# EAGLE schematic AK4493-Combi4 (EAGLE 9.6.2)
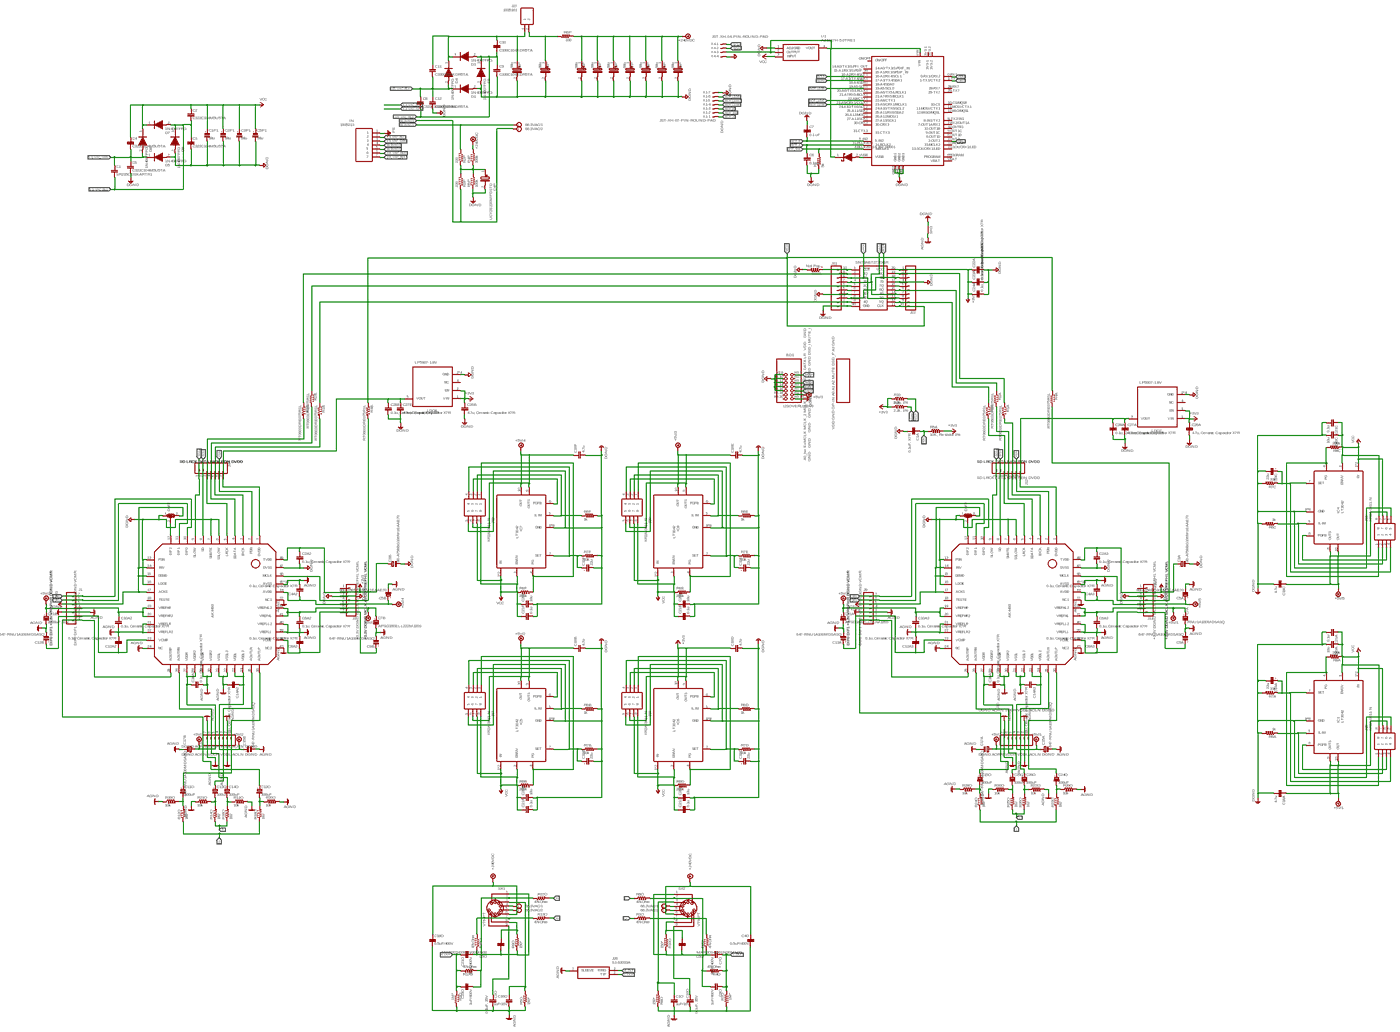
[diagram p0: schematic, sheet 1, overview]
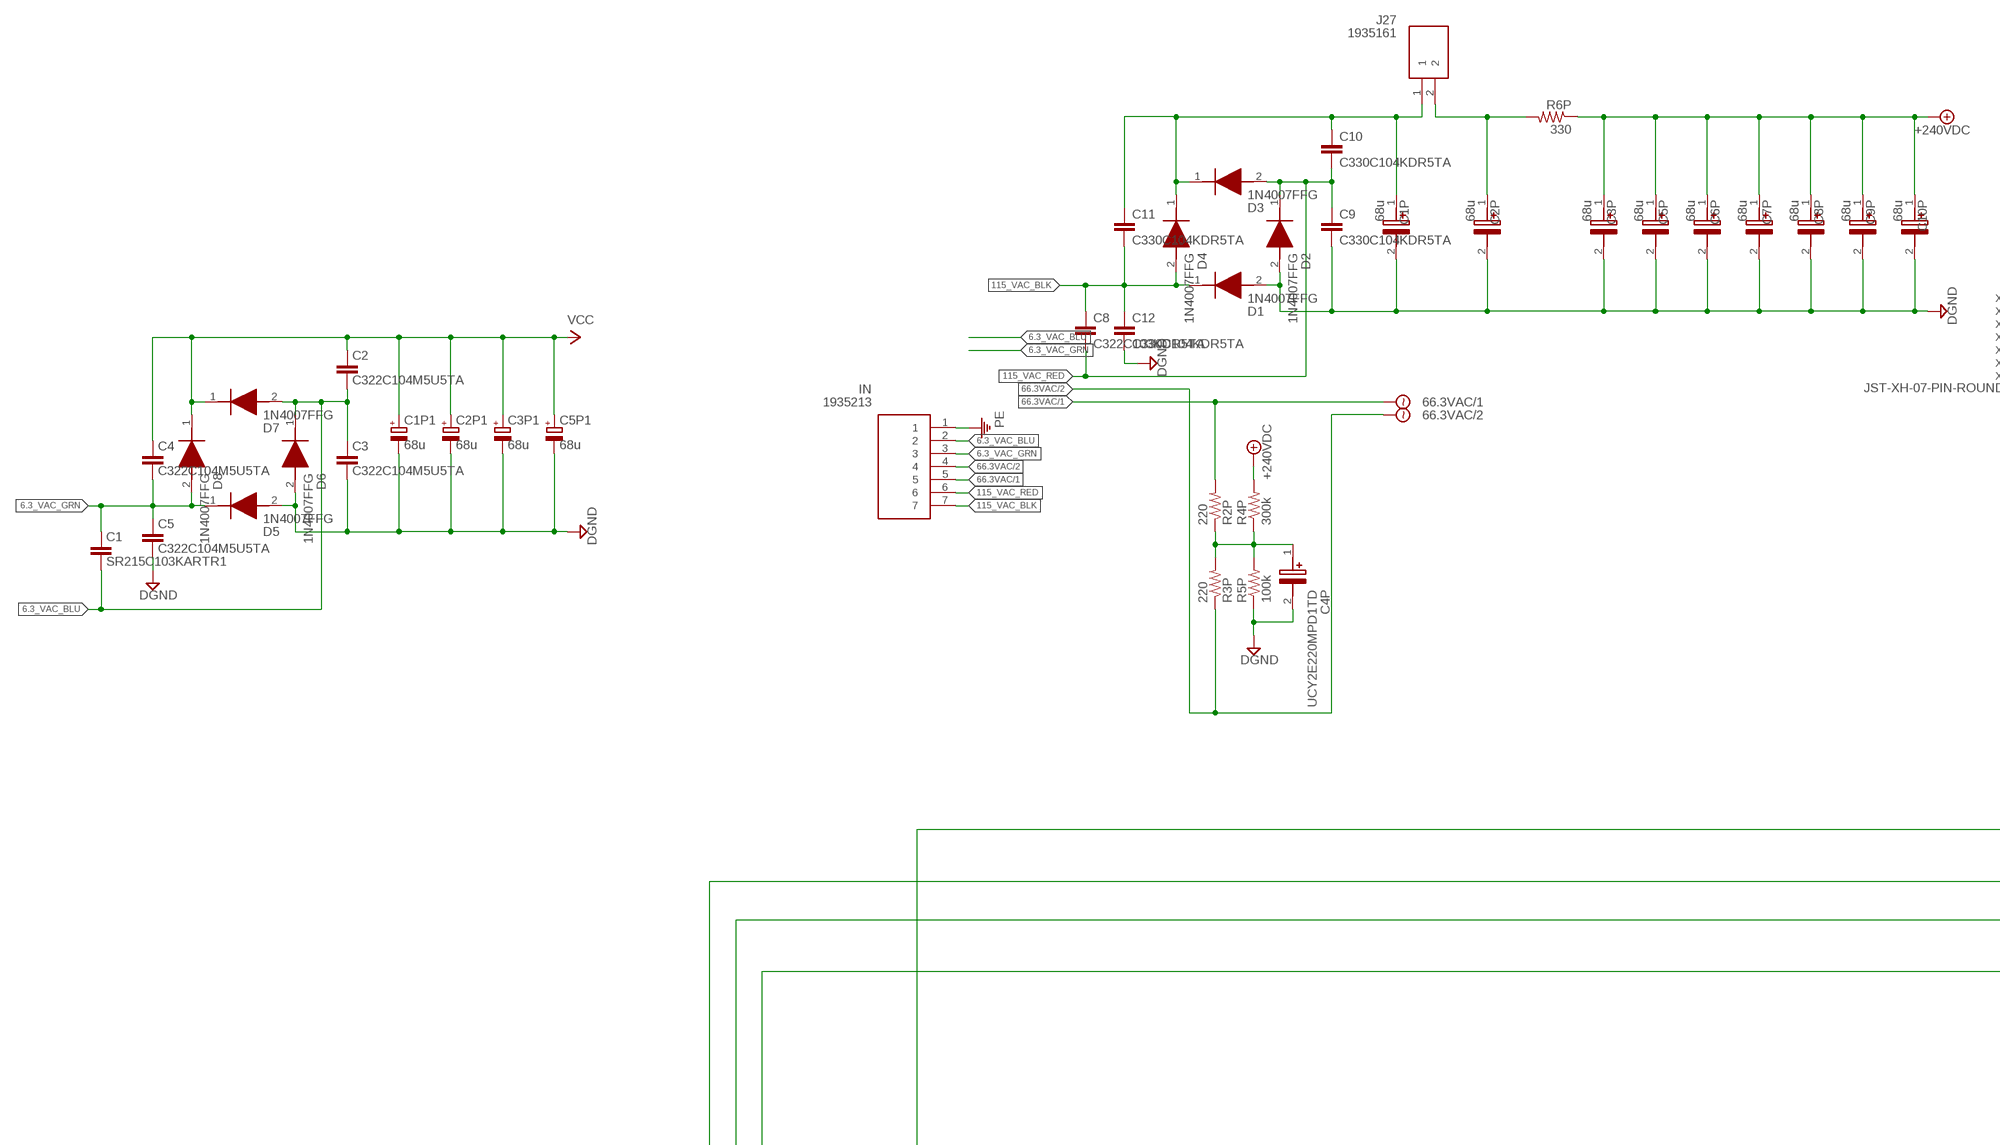
[diagram p1: schematic, sheet 1, part 1 of 4]
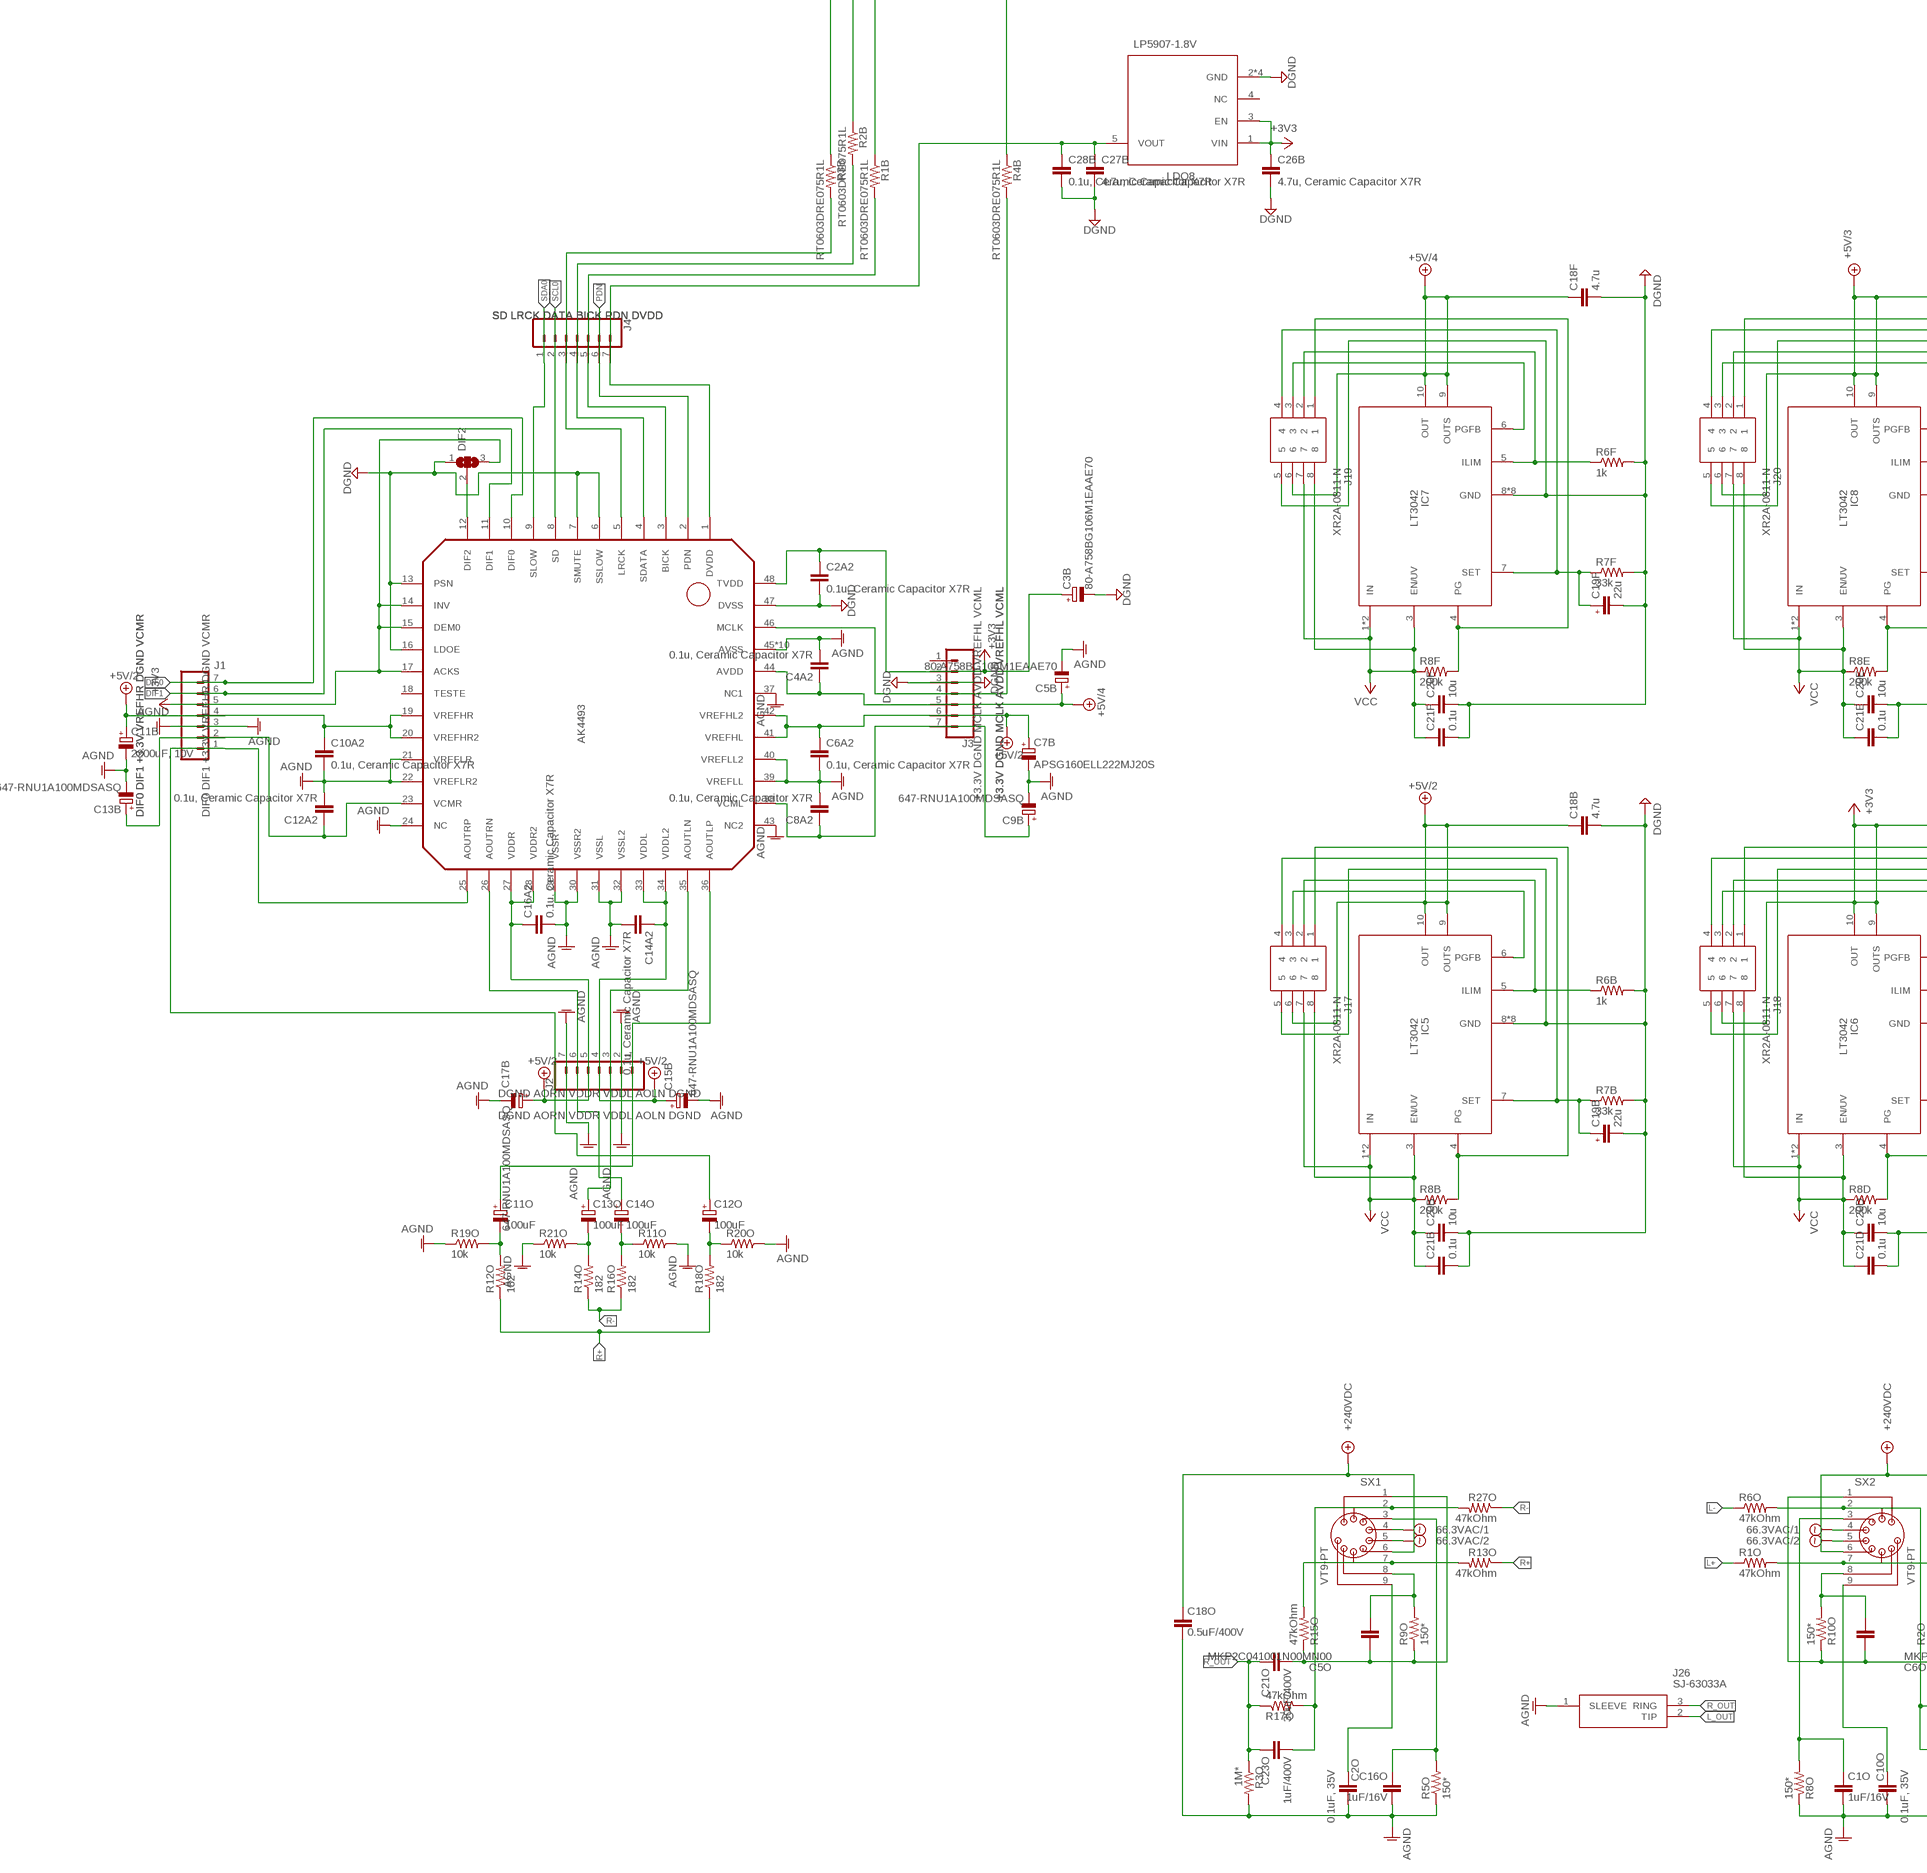
[diagram p2: schematic, sheet 1, part 2 of 4]
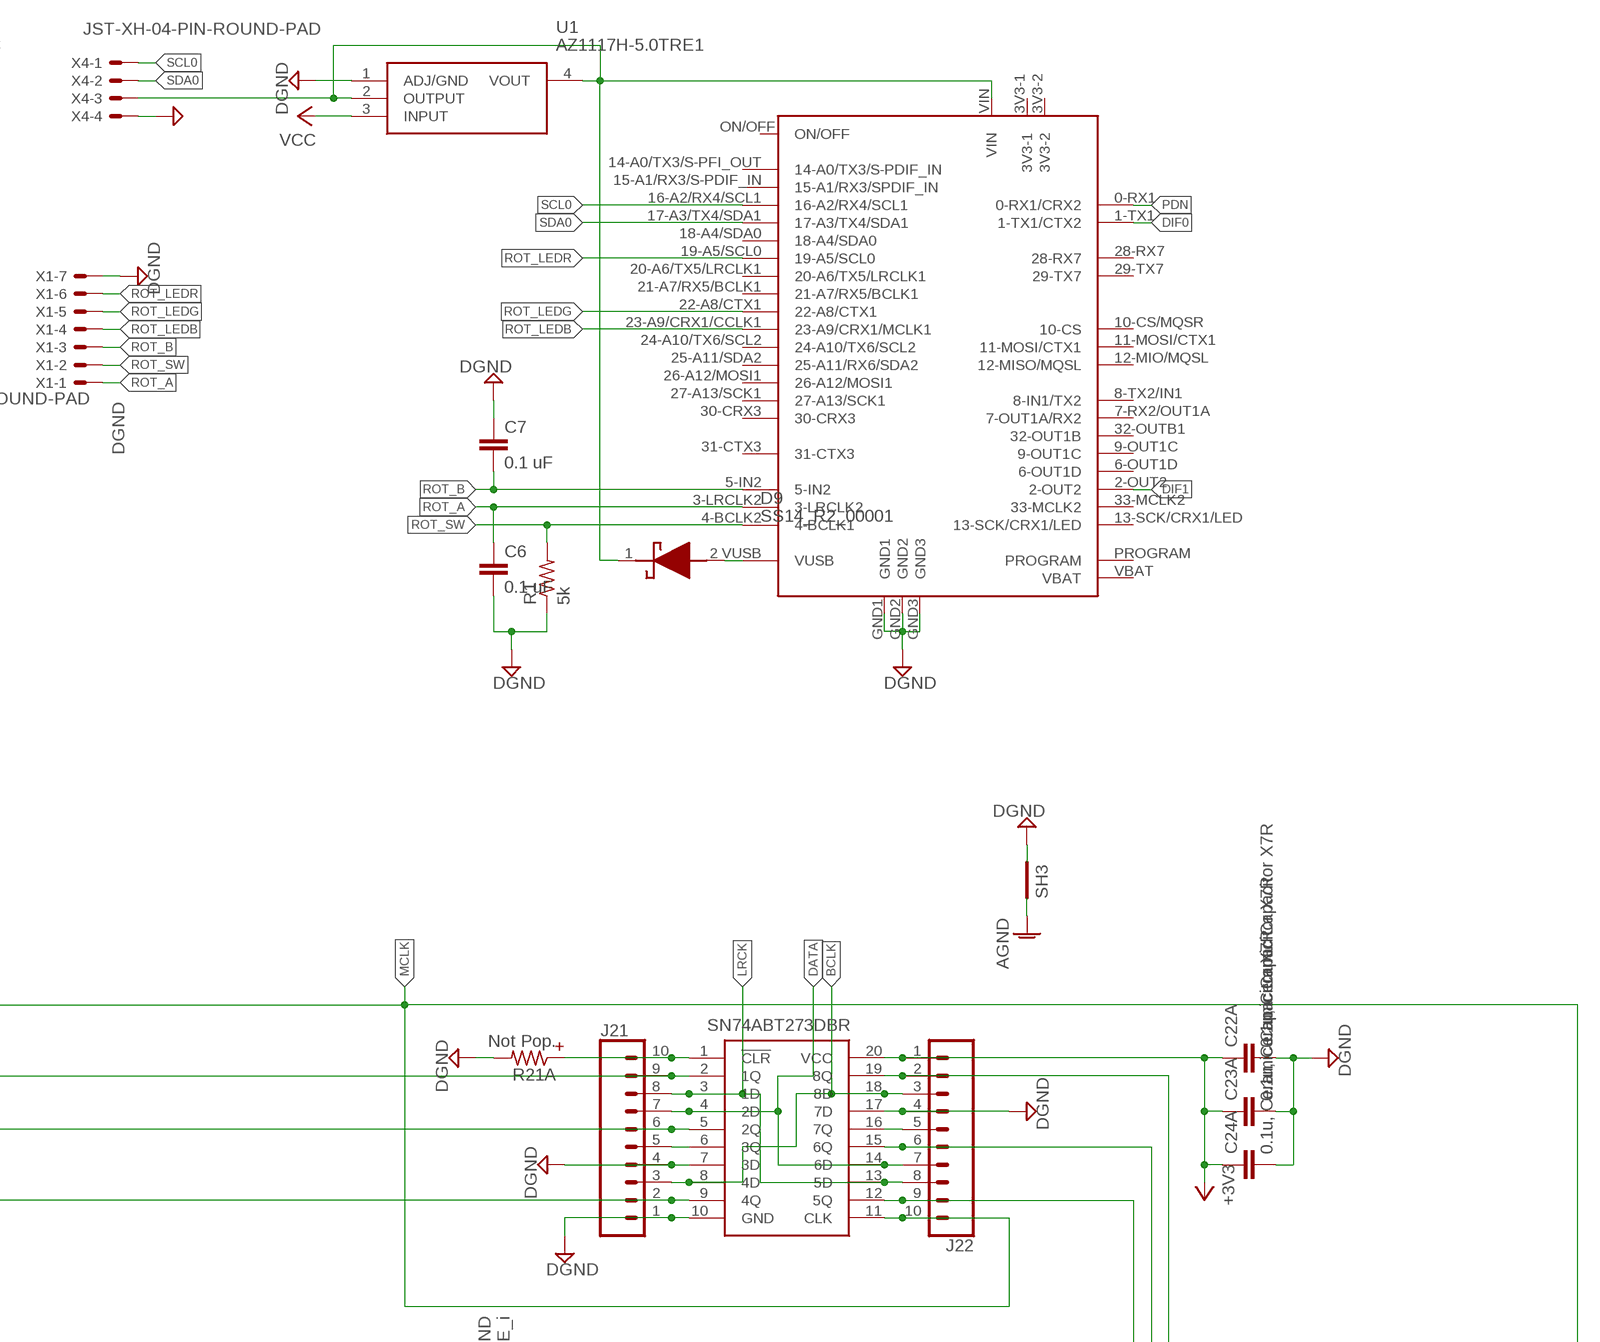
[diagram p3: schematic, sheet 1, part 3 of 4]
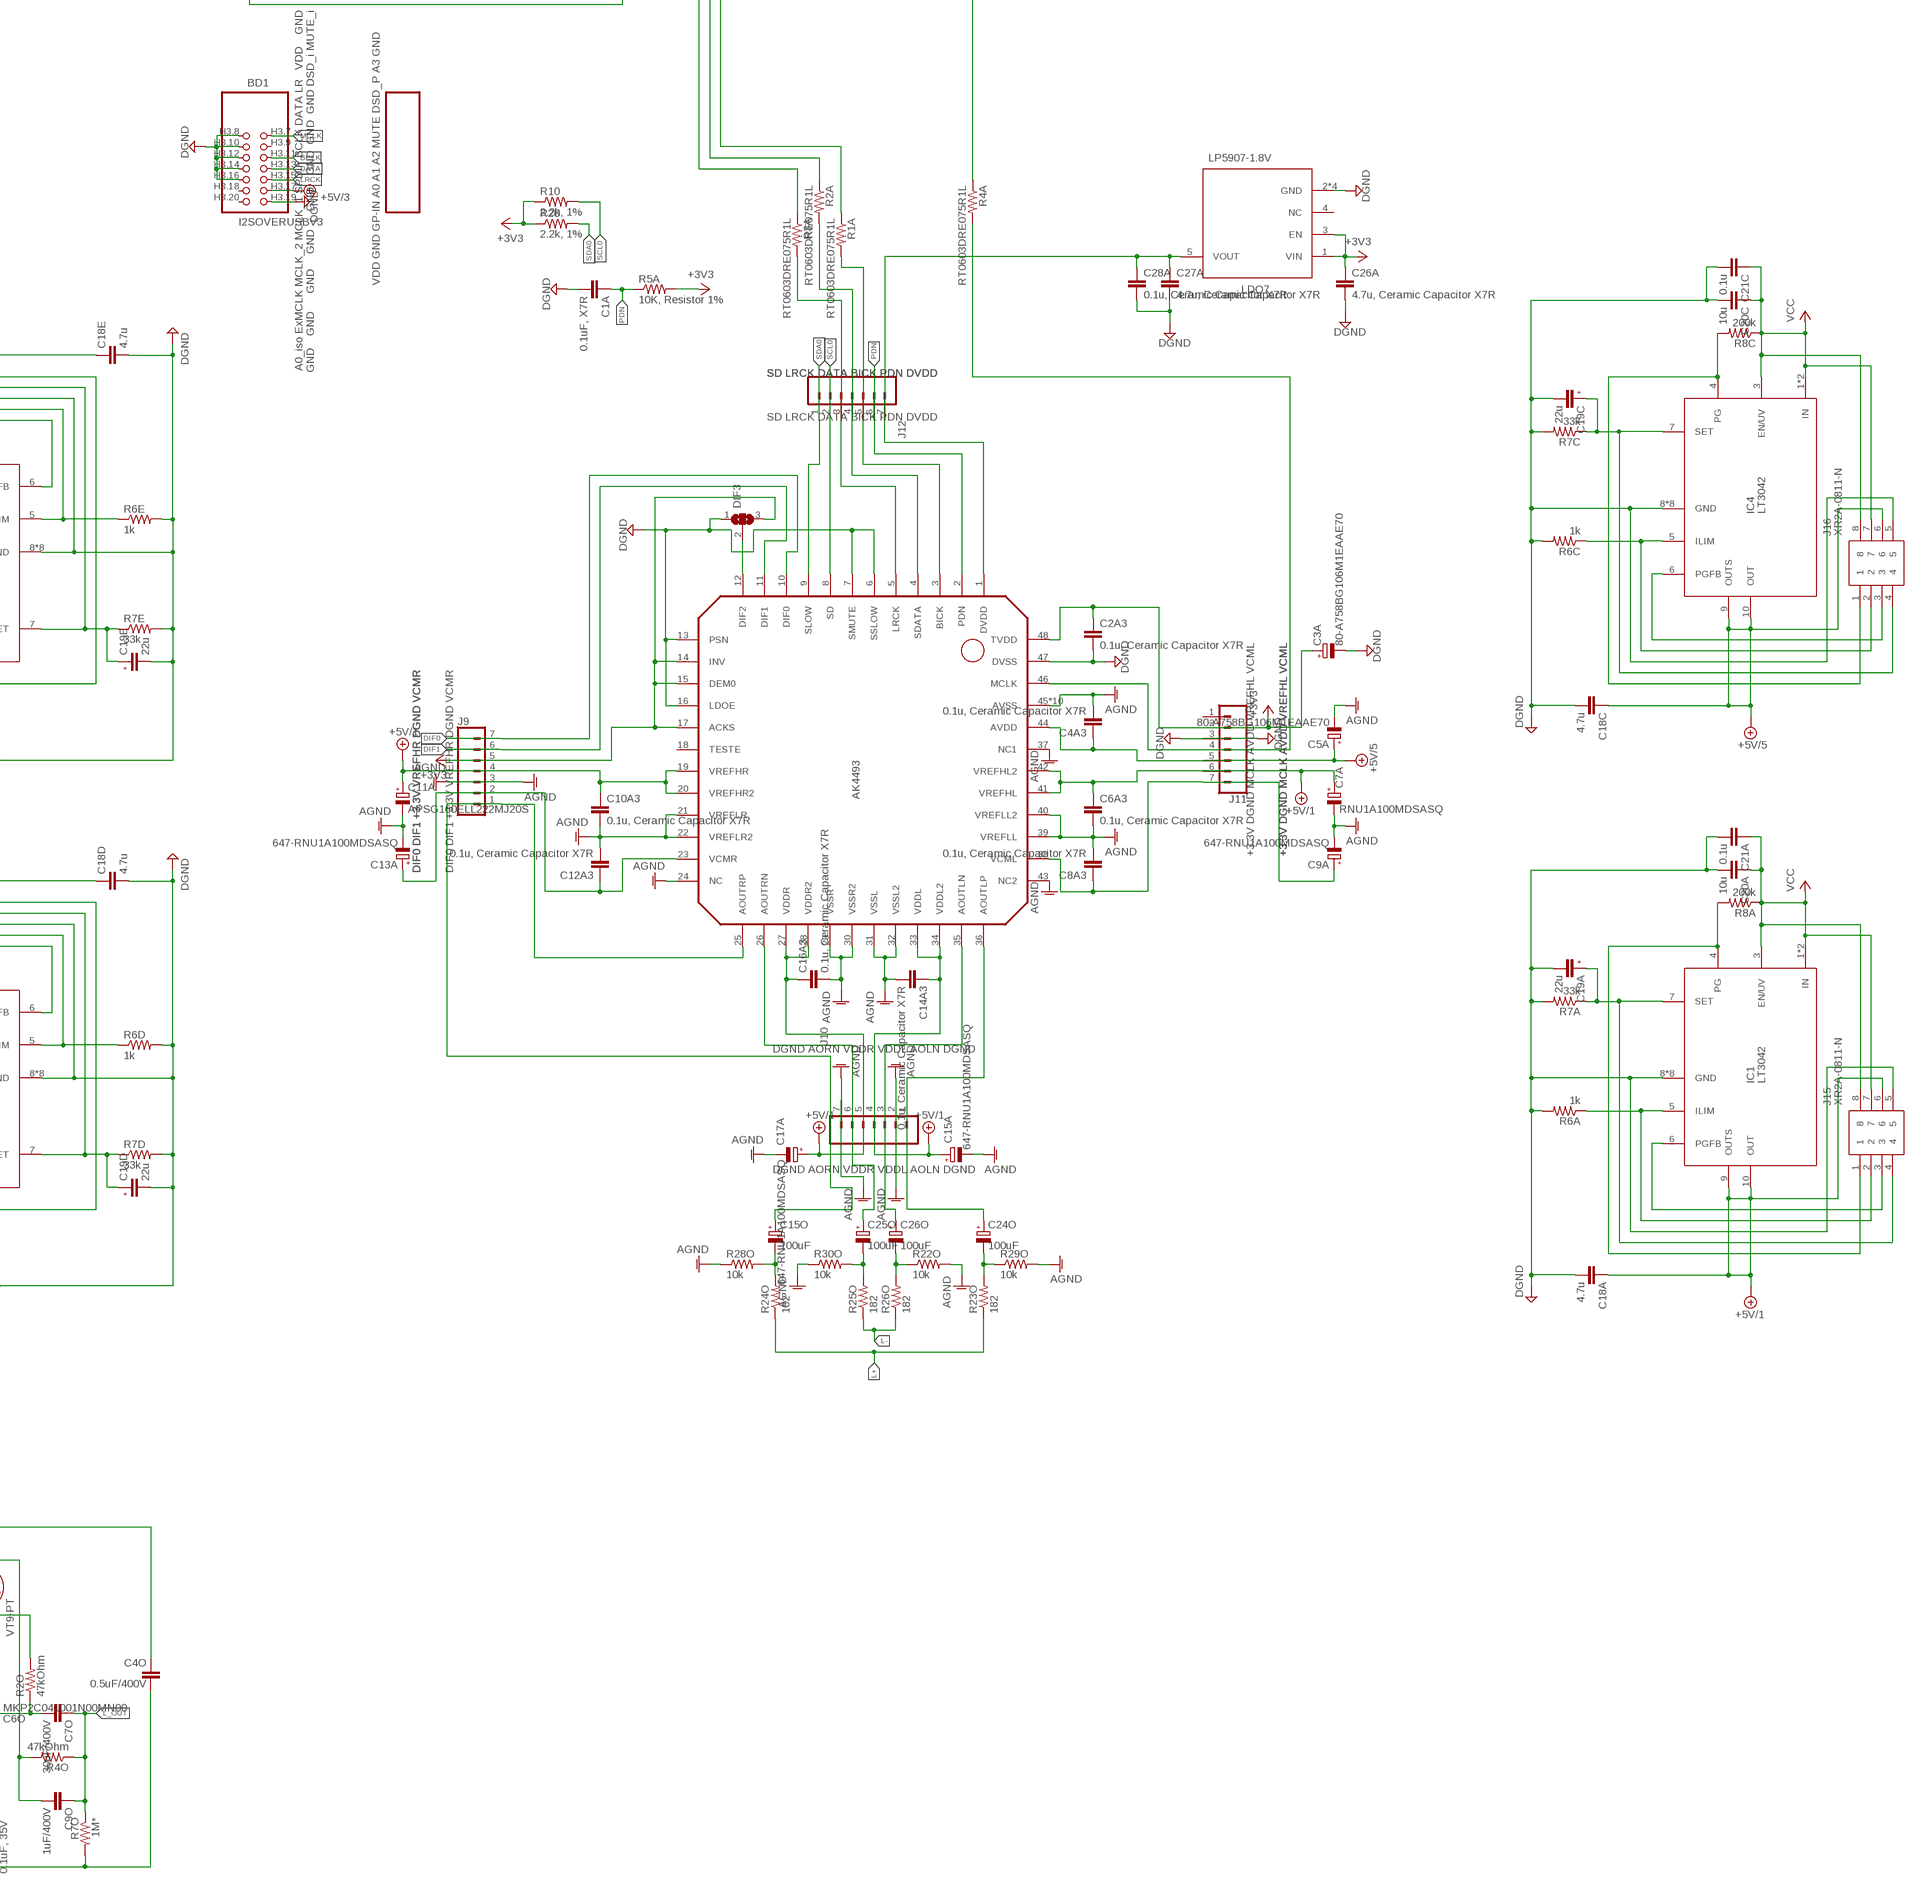
[diagram p4: schematic, sheet 1, part 4 of 4]

## Parts
BD1  I2SOVERUSBV3  [I2SOVERUSBV3]
C1  SR215C103KARTR1  [SR211C104KARTR1]
C1A  0.1uF, X7R  EMF212B7104KGHT  [CAPC2012X135N]
C1O  1uF/16V  MKP2C041001N00MN00  [MKP2C041001N00MN00]
C1P  68u  500HXW68MEFR14.5X45  [CAPPRD750W80D1475H4700]
C1P1  68u  35PX6800MEFC18X35.5  [CAPPRD750W80D1825H3750]
C2  C322C104M5U5TA  [C322C104K1R5TA]
C2A2  0.1u, Ceramic Capacitor X7R  EMK107B7104KA-T  [CAPC1608X95N]
C2A3  0.1u, Ceramic Capacitor X7R  EMK107B7104KA-T  [CAPC1608X95N]
C2O  0.1uF, 35V  MKS4B031002A00JC00  [MKS4B031002A00JC00]
C2P  68u  500HXW68MEFR14.5X45  [CAPPRD750W80D1475H4700]
C2P1  68u  35PX6800MEFC18X35.5  [CAPPRD750W80D1825H3750]
C3  C322C104M5U5TA  [C322C104K1R5TA]
C3A  80-A758BG106M1EAAE70  RNU1A100MDSASQ  [CAPPRD150W45D450H600]
C3B  80-A758BG106M1EAAE70  A758BG106M1EAAE070  [CAPPRD200W55D500H800]
C3P  68u  500HXW68MEFR14.5X45  [CAPPRD750W80D1475H4700]
C3P1  68u  35PX6800MEFC18X35.5  [CAPPRD750W80D1825H3750]
C4  C322C104M5U5TA  [C322C104K1R5TA]
C4A2  0.1u, Ceramic Capacitor X7R  EMK107B7104KA-T  [CAPC1608X95N]
C4A3  0.1u, Ceramic Capacitor X7R  EMK107B7104KA-T  [CAPC1608X95N]
C4O  0.5uF/400V  MKP4G034705D00KSSD  [MKP4G034705D00KSSD]
C4P  UCY2E220MPD1TD  [CAPPRD500W60D1025H1750]
C5  C322C104M5U5TA  [C322C104K1R5TA]
C5A  80-A758BG106M1EAAE70  A758BG106M1EAAE070  [CAPPRD200W55D500H800]
C5B  80-A758BG106M1EAAE70  A758BG106M1EAAE070  [CAPPRD200W55D500H800]
C5O  MKP2C041001N00MN00  [MKP2C041001N00MN00]
C5P  68u  500HXW68MEFR14.5X45  [CAPPRD750W80D1475H4700]
C5P1  68u  35PX6800MEFC18X35.5  [CAPPRD750W80D1825H3750]
C6  0.1 uF  EMF212B7104KGHT  [CAPC2012X135N]
C6A2  0.1u, Ceramic Capacitor X7R  EMK107B7104KA-T  [CAPC1608X95N]
C6A3  0.1u, Ceramic Capacitor X7R  EMK107B7104KA-T  [CAPC1608X95N]
C6O  MKP2C041001N00MN00  [MKP2C041001N00MN00]
C6P  68u  500HXW68MEFR14.5X45  [CAPPRD750W80D1475H4700]
C7  0.1 uF  EMF212B7104KGHT  [CAPC2012X135N]
C7A  RNU1A100MDSASQ  [CAPPRD150W45D450H600]
C7B  APSG160ELL222MJ20S  [CAPPRD500W60D1025H2150]
C7O  30uF/400V  DCP4G053006ID2KSSD  [DCP4G053006ID2KSSD]
C7P  68u  500HXW68MEFR14.5X45  [CAPPRD750W80D1475H4700]
C8  C322C103KDR5TA  [C322C101JCG5TA7301]
C8A2  0.1u, Ceramic Capacitor X7R  EMK107B7104KA-T  [CAPC1608X95N]
C8A3  0.1u, Ceramic Capacitor X7R  EMK107B7104KA-T  [CAPC1608X95N]
C8P  68u  500HXW68MEFR14.5X45  [CAPPRD750W80D1475H4700]
C9  C330C104KDR5TA  [C330C104KDR5TA]
C9A  647-RNU1A100MDSASQ  RNU1A100MDSASQ  [CAPPRD150W45D450H600]
C9B  647-RNU1A100MDSASQ  RNU1A100MDSASQ  [CAPPRD150W45D450H600]
C9O  1uF/400V  MKP4G041005I00JSSD  [MKP4G041005I00JSSD]
C9P  68u  500HXW68MEFR14.5X45  [CAPPRD750W80D1475H4700]
C10  C330C104KDR5TA  [C330C104KDR5TA]
C10A2  0.1u, Ceramic Capacitor X7R  EMK107B7104KA-T  [CAPC1608X95N]
C10A3  0.1u, Ceramic Capacitor X7R  EMK107B7104KA-T  [CAPC1608X95N]
C10O  0.1uF, 35V  MKS4B031002A00JC00  [MKS4B031002A00JC00]
C10P  68u  500HXW68MEFR14.5X45  [CAPPRD750W80D1475H4700]
C11  C330C104KDR5TA  [C330C104KDR5TA]
C11A  APSG160ELL222MJ20S  [CAPPRD500W60D1025H2150]
C11B  2200uF, 10V  APSG160ELL222MJ20S  [CAPPRD500W60D1025H2150]
C11O  100uF  UFW1H101MPD1TD  [CAPPRD350W60D825H1300]
C12  C330C104KDR5TA  [C330C104KDR5TA]
C12A2  0.1u, Ceramic Capacitor X7R  EMK107B7104KA-T  [CAPC1608X95N]
C12A3  0.1u, Ceramic Capacitor X7R  EMK107B7104KA-T  [CAPC1608X95N]
C12O  100uF  UFW1H101MPD1TD  [CAPPRD350W60D825H1300]
C13A  647-RNU1A100MDSASQ  RNU1A100MDSASQ  [CAPPRD150W45D450H600]
C13B  647-RNU1A100MDSASQ  RNU1A100MDSASQ  [CAPPRD150W45D450H600]
C13O  100uF  UFW1H101MPD1TD  [CAPPRD350W60D825H1300]
C14A2  0.1u, Ceramic Capacitor X7R  EMK107B7104KA-T  [CAPC1608X95N]
C14A3  0.1u, Ceramic Capacitor X7R  EMK107B7104KA-T  [CAPC1608X95N]
C14O  100uF  UFW1H101MPD1TD  [CAPPRD350W60D825H1300]
C15A  647-RNU1A100MDSASQ  RNU1A100MDSASQ  [CAPPRD150W45D450H600]
C15B  647-RNU1A100MDSASQ  RNU1A100MDSASQ  [CAPPRD150W45D450H600]
C15O  100uF  UFW1H101MPD1TD  [CAPPRD350W60D825H1300]
C16A2  0.1u, Ceramic Capacitor X7R  EMK107B7104KA-T  [CAPC1608X95N]
C16A3  0.1u, Ceramic Capacitor X7R  EMK107B7104KA-T  [CAPC1608X95N]
C16O  1uF/16V  MKP2C041001N00MN00  [MKP2C041001N00MN00]
C17A  647-RNU1A100MDSASQ  RNU1A100MDSASQ  [CAPPRD150W45D450H600]
C17B  647-RNU1A100MDSASQ  RNU1A100MDSASQ  [CAPPRD150W45D450H600]
C18A  4.7u  EMK212ABJ475KG-T  [CAPC2013X140N]
C18B  4.7u  EMK212ABJ475KG-T  [CAPC2013X140N]
C18C  4.7u  EMK212ABJ475KG-T  [CAPC2013X140N]
C18D  4.7u  EMK212ABJ475KG-T  [CAPC2013X140N]
C18E  4.7u  EMK212ABJ475KG-T  [CAPC2013X140N]
C18F  4.7u  EMK212ABJ475KG-T  [CAPC2013X140N]
C18O  0.5uF/400V  MKP4G034705D00KSSD  [MKP4G034705D00KSSD]
C19A  22u  EMK316BB7226ML-T  [C1206]
C19B  22u  EMK316BB7226ML-T  [C1206]
C19C  22u  EMK316BB7226ML-T  [C1206]
C19D  22u  EMK316BB7226ML-T  [C1206]
C19E  22u  EMK316BB7226ML-T  [C1206]
C19F  22u  EMK316BB7226ML-T  [C1206]
C20A  10u  EMK212BB7106KG-T  [CAPC2012X135N]
C20B  10u  EMK212BB7106KG-T  [CAPC2012X135N]
C20C  10u  EMK212BB7106KG-T  [CAPC2012X135N]
C20D  10u  EMK212BB7106KG-T  [CAPC2012X135N]
C20E  10u  EMK212BB7106KG-T  [CAPC2012X135N]
C20F  10u  EMK212BB7106KG-T  [CAPC2012X135N]
C21A  0.1u  EMF212B7104KGHT  [CAPC2012X135N]
C21B  0.1u  EMF212B7104KGHT  [CAPC2012X135N]
C21C  0.1u  EMF212B7104KGHT  [CAPC2012X135N]
C21D  0.1u  EMF212B7104KGHT  [CAPC2012X135N]
C21E  0.1u  EMF212B7104KGHT  [CAPC2012X135N]
C21F  0.1u  EMF212B7104KGHT  [CAPC2012X135N]
C21O  30uF/400V  DCP4G053006ID2KSSD  [DCP4G053006ID2KSSD]
C22A  0.1u, Ceramic Capacitor X7R  EMF212B7104KGHT  [CAPC2012X135N]
C23A  0.1u, Ceramic Capacitor X7R  EMF212B7104KGHT  [CAPC2012X135N]
C23O  1uF/400V  MKP4G041005I00JSSD  [MKP4G041005I00JSSD]
C24A  0.1u, Ceramic Capacitor X7R  EMF212B7104KGHT  [CAPC2012X135N]
C24O  100uF  UFW1H101MPD1TD  [CAPPRD350W60D825H1300]
C25O  100uF  UFW1H101MPD1TD  [CAPPRD350W60D825H1300]
C26A  4.7u, Ceramic Capacitor X7R  EMK212ABJ475KG-T  [CAPC2013X140N]
C26B  4.7u, Ceramic Capacitor X7R  EMK212ABJ475KG-T  [CAPC2013X140N]
C26O  100uF  UFW1H101MPD1TD  [CAPPRD350W60D825H1300]
C27A  4.7u, Ceramic Capacitor X7R  EMK212ABJ475KG-T  [CAPC2013X140N]
C27B  4.7u, Ceramic Capacitor X7R  EMK212ABJ475KG-T  [CAPC2013X140N]
C28A  0.1u, Ceramic Capacitor X7R  EMF212B7104KGHT  [CAPC2012X135N]
C28B  0.1u, Ceramic Capacitor X7R  EMF212B7104KGHT  [CAPC2012X135N]
D1  1N4007FFG  [DIOAD1405W86L465D235]
D2  1N4007FFG  [DIOAD1405W86L465D235]
D3  1N4007FFG  [DIOAD1405W86L465D235]
D4  1N4007FFG  [DIOAD1405W86L465D235]
D5  1N4007FFG  [DIOAD1405W86L465D235]
D6  1N4007FFG  [DIOAD1405W86L465D235]
D7  1N4007FFG  [DIOAD1405W86L465D235]
D8  1N4007FFG  [DIOAD1405W86L465D235]
D9  SS14_R2_00001  [DIOM5027X244N]
DIF2  SJ2W  [SJ_2]
DIF3  SJ2W  [SJ_2]
IC1  LT3042  [SOP50P490X110-11N]
IC3  AK4493  [LQFP48_]
IC4  LT3042  [SOP50P490X110-11N]
IC4A  SN74ABT273DBR  [SOP65P780X200-20N]
IC5  LT3042  [SOP50P490X110-11N]
IC6  LT3042  [SOP50P490X110-11N]
IC7  LT3042  [SOP50P490X110-11N]
IC8  LT3042  [SOP50P490X110-11N]
IC9  AK4493  [LQFP48_]
IN  1935213  [1935213]
J1  CONN_07  [1X07]
J2  CONN_07  [1X07]
J3  CONN_07  [1X07]
J4  CONN_07  [1X07]
J9  CONN_07  [1X07]
J10  CONN_07  [1X07]
J11  CONN_07  [1X07]
J12  CONN_07  [1X07]
J15  XR2A-0811-N  [DIPS762W51P254L1016H390Q8N]
J16  XR2A-0811-N  [DIPS762W51P254L1016H390Q8N]
J17  XR2A-0811-N  [DIPS762W51P254L1016H390Q8N]
J18  XR2A-0811-N  [DIPS762W51P254L1016H390Q8N]
J19  XR2A-0811-N  [DIPS762W51P254L1016H390Q8N]
J20  XR2A-0811-N  [DIPS762W51P254L1016H390Q8N]
J21  CONN_10"  [1X10]
J22  CONN_10"  [1X10]
J26  SJ-63033A  [SJ63033A]
J27  1935161  [1935161]
LDO7  LP5907-1.8V  [SOT95P280X145-5N]
LDO8  LP5907-1.8V  [SOT95P280X145-5N]
R1  5k  ERJ-P06J512V  [ERJP06D1000V]
R1A  RT0603DRE075R1L  [RESC1608X55N]
R1B  RT0603DRE075R1L  [RESC1608X55N]
R1O  47kOhm  LR1F47K  [RESAD1540W55L620D230]
R2A  RT0603DRE075R1L  [RESC1608X55N]
R2B  RT0603DRE075R1L  [RESC1608X55N]
R2O  47kOhm  LR1F47K  [RESAD1540W55L620D230]
R2P  220  PR02000202200JA1000411/15  [0411/15]
R3A  RT0603DRE075R1L  [RESC1608X55N]
R3B  RT0603DRE075R1L  [RESC1608X55N]
R3O  1M*  LR1F1M0  [RESAD1540W60L620D230]
R3P  220  PR02000202200JA1000411/15  [0411/15]
R4A  RT0603DRE075R1L  [RESC1608X55N]
R4B  RT0603DRE075R1L  [RESC1608X55N]
R4O  47kOhm  LR1F47K  [RESAD1540W55L620D230]
R4P  300k  PR02000203003JR5000411/15  [0411/15]
R5A  10K, Resistor 1%  RCS080510K0FKEA  [RESC2012X50N]
R5O  150*  LR1F150R  [RESAD1540W55L620D230]
R5P  100k  PR02000201003JA1000411/15  [0411/15]
R6A  1k  CHP0805-FX-1001ELF  [RESC2012X60N]
R6B  1k  CHP0805-FX-1001ELF  [RESC2012X60N]
R6C  1k  CHP0805-FX-1001ELF  [RESC2012X60N]
R6D  1k  CHP0805-FX-1001ELF  [RESC2012X60N]
R6E  1k  CHP0805-FX-1001ELF  [RESC2012X60N]
R6F  1k  CHP0805-FX-1001ELF  [RESC2012X60N]
R6O  47kOhm  LR1F47K  [RESAD1540W55L620D230]
R6P  330  PR02000203300JA1000411/15  [0411/15]
R7A  33k  CPF0805B51KE1  [R0805]
R7B  33k  CPF0805B51KE1  [R0805]
R7C  33k  CPF0805B51KE1  [R0805]
R7D  33k  CPF0805B51KE1  [R0805]
R7E  33k  CPF0805B51KE1  [R0805]
R7F  33k  CPF0805B51KE1  [R0805]
R7O  1M*  LR1F1M0  [RESAD1540W60L620D230]
R8A  200k  RR1220P-204-D  [R0805]
R8B  200k  RR1220P-204-D  [R0805]
R8C  200k  RR1220P-204-D  [R0805]
R8D  200k  RR1220P-204-D  [R0805]
R8E  200k  RR1220P-204-D  [R0805]
R8F  200k  RR1220P-204-D  [R0805]
R8O  150*  LR1F150R  [RESAD1540W55L620D230]
R9O  150*  LR1F150R  [RESAD1540W55L620D230]
R10  2.2k, 1%  RCS08052K20FKEA  [RCS0805_E3]
R10O  150*  LR1F150R  [RESAD1540W55L620D230]
R11O  10k  LR1F10K  [RESAD1540W55L620D230]
R12O  182  MF0207FTE52-182R  [RESAD1590W60L630D240]
R13O  47kOhm  LR1F47K  [RESAD1540W55L620D230]
R14O  182  MF0207FTE52-182R  [RESAD1590W60L630D240]
R15O  47kOhm  LR1F47K  [RESAD1540W55L620D230]
R16O  182  MF0207FTE52-182R  [RESAD1590W60L630D240]
R17O  47kOhm  LR1F47K  [RESAD1540W55L620D230]
R18O  182  MF0207FTE52-182R  [RESAD1590W60L630D240]
R19O  10k  LR1F10K  [RESAD1540W55L620D230]
R20  2.2k, 1%  RCS08052K20FKEA  [RCS0805_E3]
R20O  10k  LR1F10K  [RESAD1540W55L620D230]
R21A  Not Pop.  R-POLR0805  [R0805-POL]
R21O  10k  LR1F10K  [RESAD1540W55L620D230]
R22O  10k  LR1F10K  [RESAD1540W55L620D230]
R23O  182  MF0207FTE52-182R  [RESAD1590W60L630D240]
R24O  182  MF0207FTE52-182R  [RESAD1590W60L630D240]
R25O  182  MF0207FTE52-182R  [RESAD1590W60L630D240]
R26O  182  MF0207FTE52-182R  [RESAD1590W60L630D240]
R27O  47kOhm  LR1F47K  [RESAD1540W55L620D230]
R28O  10k  LR1F10K  [RESAD1540W55L620D230]
R29O  10k  LR1F10K  [RESAD1540W55L620D230]
R30O  10k  LR1F10K  [RESAD1540W55L620D230]
SH3  SHORTA5  [SHORT_ALL-50]
SX1  VT9-PT  [VT9-PT]
SX2  VT9-PT  [VT9-PT]
U1  AZ1117H-5.0TRE1  [SOT230P700X180-4N]
U$1  TEENSY40  [TEENSY40]
X1  JST-XH-07-PIN-ROUND-PAD  [JST-XH-07-PACKAGE-ROUND-PAD]
X4  JST-XH-04-PIN-ROUND-PAD  [JST-XH-04-PACKAGE-ROUND-PAD]

## Nets
6.3_VAC_BLU: C1.2 C2.2 C3.1 D6.1(K) D7.2(A) IN.2
6.3_VAC_GRN: C1.1 C4.2 C5.1 D5.1(K) D8.2(A) IN.3
66.3VAC/1: IN.5 R2P.2 SX1.4 SX2.4
66.3VAC/2: IN.4 R3P.1 SX1.5 SX2.5
115_VAC_BLK: C8.1 C11.2 C12.1 D1.1(K) D4.2(A) IN.7
115_VAC_RED: C8.2 C9.1 C10.2 D2.1(K) D3.2(A) IN.6
+3V3: C2A2.1 C2A3.1 C3A.1(+) C3B.1(+) C18D.1 C22A.1 C23A.1 C24A.1 C26A.1 C26B.1 DIF3.3 IC3.48(TVDD) IC4A.20(VCC) IC6.9(OUTS) IC6.10(OUT) IC9.14(INV) IC9.15(DEM0) IC9.17(ACKS) IC9.48(TVDD) J3.2 J9.5 J11.2 J18.6 J22.1 LDO7.1(VIN) LDO7.3(EN) LDO8.1(VIN) LDO8.3(EN) R5A.2 R10.1 R20.1
+5V/1: C6A3.1 C7A.1(+) C10A3.1 C11A.1(+) C14A3.1 C15A.1(+) C16A3.1 C17A.1(+) C18A.1 IC1.9(OUTS) IC1.10(OUT) IC9.19(VREFHR) IC9.20(VREFHR2) IC9.27(VDDR) IC9.28(VDDR2) IC9.33(VDDL) IC9.34(VDDL2) IC9.41(VREFHL) IC9.42(VREFHL2) J9.4 J10.4 J10.5 J11.6 J15.6
+5V/2: C6A2.1 C7B.1(+) C10A2.1 C11B.1(+) C14A2.1 C15B.1(+) C16A2.1 C17B.1(+) C18B.1 IC3.19(VREFHR) IC3.20(VREFHR2) IC3.27(VDDR) IC3.28(VDDR2) IC3.33(VDDL) IC3.34(VDDL2) IC3.41(VREFHL) IC3.42(VREFHL2) IC5.9(OUTS) IC5.10(OUT) J1.4 J2.4 J2.5 J3.6 J17.6
+5V/3: BD1.H3.17 C18E.1 IC8.9(OUTS) IC8.10(OUT) J20.6
+5V/4: C4A2.1 C5B.1(+) C18F.1 IC3.44(AVDD) IC7.9(OUTS) IC7.10(OUT) J3.5 J19.6
+5V/5: C4A3.1 C5A.1(+) C18C.1 IC4.9(OUTS) IC4.10(OUT) IC9.44(AVDD) J11.5 J16.6
+240VDC: C3P.1(+) C4O.1 C5P.1(+) C6P.1(+) C7P.1(+) C8P.1(+) C9P.1(+) C10P.1(+) C18O.1 R4P.2 R6P.1 SX1.6 SX2.6
AGND: C1O.2 C2O.2 C4A2.2 C4A3.2 C4O.2 C5A.2(-) C5B.2(-) C6A2.2 C6A3.2 C7A.2(-) C7B.2(-) C8A2.2 C8A3.2 C9A.2(-) C9B.2(-) C10A2.2 C10A3.2 C10O.2 C11A.2(-) C11B.2(-) C12A2.2 C12A3.2 C13A.2(-) C13B.2(-) C14A2.2 C14A3.2 C15A.2(-) C15B.2(-) C16A2.2 C16A3.2 C16O.2 C17A.2(-) C17B.2(-) C18O.2 IC3.21(VREFLR) IC3.22(VREFLR2) IC3.24(NC) IC3.29(VSSR) IC3.30(VSSR2) IC3.31(VSSL) IC3.32(VSSL2) IC3.37(NC1) IC3.39(VREFLL) IC3.40(VREFLL2) IC3.43(NC2) IC3.45(AVSS) IC3.P$1(AVSS) IC3.P$2(AVSS) IC3.P$4(AVSS) IC3.P$6(AVSS) IC3.P$8(AVSS) IC3.P$10(AVSS) IC3.P$17(AVSS) IC3.P$18(AVSS) IC3.P$25(AVSS) IC9.21(VREFLR) IC9.22(VREFLR2) IC9.24(NC) IC9.29(VSSR) IC9.30(VSSR2) IC9.31(VSSL) IC9.32(VSSL2) IC9.37(NC1) IC9.39(VREFLL) IC9.40(VREFLL2) IC9.43(NC2) IC9.45(AVSS) IC9.P$1(AVSS) IC9.P$2(AVSS) IC9.P$4(AVSS) IC9.P$6(AVSS) IC9.P$8(AVSS) IC9.P$10(AVSS) IC9.P$17(AVSS) IC9.P$18(AVSS) IC9.P$25(AVSS) J1.3 J2.2 J2.7 J9.3 J10.2 J10.7 J26.1(SLEEVE) R3O.2 R5O.1 R7O.2 R8O.1 R11O.2 R19O.1 R20O.2 R21O.1 R22O.2 R28O.1 R29O.2 R30O.1 SH3.2
BCLK: BD1.H3.11 IC4A.8(4D) IC4A.18(8D) J21.3 J22.3
DATA: BD1.H3.13 IC4A.4(2D) IC4A.14(6D) J21.7 J22.7
DGND: BD1.H3.8 BD1.H3.10 BD1.H3.12 BD1.H3.14 BD1.H3.16 BD1.H3.19 C1A.2 C1P1.2(-) C1P.2(-) C2A2.2 C2A3.2 C2P1.2(-) C2P.2(-) C3.2 C3A.2(-) C3B.2(-) C3P1.2(-) C3P.2(-) C4P.2(-) C5.2 C5P1.2(-) C5P.2(-) C6.2 C6P.2(-) C7.1 C7P.2(-) C8P.2(-) C9.2 C9P.2(-) C10P.2(-) C12.2 C18A.2 C18B.2 C18C.2 C18D.2 C18E.2 C18F.2 C19A.2 C19A.3 C19B.2 C19B.3 C19C.2 C19C.3 C19D.2 C19D.3 C19E.2 C19E.3 C19F.2 C19F.3 C20A.2 C20B.2 C20C.2 C20D.2 C20E.2 C20F.2 C21A.2 C21B.2 C21C.2 C21D.2 C21E.2 C21F.2 C22A.2 C23A.2 C24A.2 C26A.2 C26B.2 C27A.2 C27B.2 C28A.2 C28B.2 D1.2(A) D2.2(A) D5.2(A) D6.2(A) DIF2.1 DIF3.1 IC1.8(GND) IC1.11(GND) IC1.P$1(GND) IC1.P$2(GND) IC1.P$3(GND) IC1.P$4(GND) IC1.P$5(GND) IC1.P$6(GND) IC3.6(SSLOW) IC3.7(SMUTE) IC3.13(PSN) IC3.16(LDOE) IC3.47(DVSS) IC4.8(GND) IC4.11(GND) IC4.P$1(GND) IC4.P$2(GND) IC4.P$3(GND) IC4.P$4(GND) IC4.P$5(GND) IC4.P$6(GND) IC4A.7(3D) IC4A.10(GND) IC4A.17(7D) IC5.8(GND) IC5.11(GND) IC5.P$1(GND) IC5.P$2(GND) IC5.P$3(GND) IC5.P$4(GND) IC5.P$5(GND) IC5.P$6(GND) IC6.8(GND) IC6.11(GND) IC6.P$1(GND) IC6.P$2(GND) IC6.P$3(GND) IC6.P$4(GND) IC6.P$5(GND) IC6.P$6(GND) IC7.8(GND) IC7.11(GND) IC7.P$1(GND) IC7.P$2(GND) IC7.P$3(GND) IC7.P$4(GND) IC7.P$5(GND) IC7.P$6(GND) IC8.8(GND) IC8.11(GND) IC8.P$1(GND) IC8.P$2(GND) IC8.P$3(GND) IC8.P$4(GND) IC8.P$5(GND) IC8.P$6(GND) IC9.6(SSLOW) IC9.7(SMUTE) IC9.13(PSN) IC9.16(LDOE) IC9.47(DVSS) J3.3 J11.3 J15.5 J16.5 J17.5 J18.5 J19.5 J20.5 J21.1 J21.4 J22.4 LDO7.2(GND) LDO7.6(GND) LDO7.7(GND) LDO7.8(GND) LDO8.2(GND) LDO8.6(GND) LDO8.7(GND) LDO8.8(GND) R1.1 R5P.1 R6A.2 R6B.2 R6C.2 R6D.2 R6E.2 R6F.2 R7A.2 R7B.2 R7C.2 R7D.2 R7E.2 R7F.2 R21A.2 R21A.3 SH3.1 U1.1(ADJ/GND) U$1.GND1 U$1.GND2 U$1.GND3 X1.7 X4.4
DIF0: IC3.10(DIF0) IC9.10(DIF0) J1.7 J9.7 U$1.1-TX1(1-TX1/CTX2)
DIF1: IC3.11(DIF1) IC9.11(DIF1) J1.6 J9.6 U$1.2-OUT2
L+: R1O.1 R23O.1 R24O.1
L-: R6O.1 R25O.1 R26O.1
L_OUT: C7O.1 C9O.1 J26.2(TIP) R4O.1 R7O.1
LRCK: BD1.H3.15 IC4A.3(1D) IC4A.13(5D) J21.8 J22.8
MCLK: BD1.H3.7 IC4A.11(CLK) J22.10 R4A.1 R4B.1
N$1: IC4A.1(!CLR) J21.10 R21A.1
N$2: C8A2.1 C9B.1(+) IC3.38(VCML) J3.7
N$3: C5O.1 C21O.2 R9O.1 R15O.1 SX1.1
N$4: IC4A.6(3Q) J21.5
N$5: IC4A.16(7Q) J22.5
N$6: C23O.2 R17O.2 R27O.2 SX1.2
N$7: C16O.1 R5O.2 SX1.3
N$8: C2O.1 SX1.9
N$9: R1O.2 R2O.2 SX2.7
N$10: C6O.1 C7O.2 R2O.1 R10O.1 SX2.1
N$11: C9O.2 R4O.2 R6O.2 SX2.2
N$12: C1O.1 R8O.2 SX2.3
N$13: C10O.1 SX2.9
N$14: C19A.1 IC1.7(SET) J15.4 R7A.1
N$15: D9.2(A) U$1.VUSB
N$16: R13O.2 R15O.2 SX1.7
N$17: IC5.4(PG) J17.1 R8B.2
N$18: IC5.6(PGFB) J17.3
N$22: IC5.5(ILIM) J17.2 R6B.1
N$23: IC4A.19(8Q) J22.2 R1A.1
N$24: IC4A.15(6Q) J22.6 R2A.1
N$25: IC4A.12(5Q) J22.9 R3A.1
N$30: IC4A.9(4Q) J21.2 R1B.1
N$31: IC4A.5(2Q) J21.6 R2B.1
N$32: IC4A.2(1Q) J21.9 R3B.1
N$33: C11O.2(-) R12O.2 R19O.2
N$34: IC6.4(PG) J18.1 R8D.2
N$35: IC3.46(MCLK) J3.4 R4B.2
N$36: IC7.5(ILIM) J19.2 R6F.1
N$38: IC6.6(PGFB) J18.3
N$39: D9.1(K) U1.2(OUTPUT) U1.4(VOUT) U$1.VIN X4.3
N$40: IC6.5(ILIM) J18.2 R6D.1
N$41: IC1.6(PGFB) J15.3
N$42: C19D.1 IC6.7(SET) J18.4 R7D.1
N$43: IC7.4(PG) J19.1 R8F.2
N$44: C12O.2(-) R18O.2 R20O.1
N$46: C19F.1 IC7.7(SET) J19.4 R7F.1
N$47: IC8.4(PG) J20.1 R8E.2
N$49: C14O.2(-) R11O.1 R16O.2
N$50: C13O.2(-) R14O.2 R21O.2
N$51: IC8.6(PGFB) J20.3
N$52: IC8.5(ILIM) J20.2 R6E.1
N$53: C19E.1 IC8.7(SET) J20.4 R7E.1
N$55: C15O.2(-) R24O.2 R28O.2
N$57: C24O.2(-) R23O.2 R29O.1
N$60: C26O.2(-) R22O.1 R26O.2
N$61: C25O.2(-) R25O.2 R30O.2
N$62: C5O.2 R9O.2 SX1.8
N$63: C6O.2 R10O.2 SX2.8
N$64: C1P.1(+) C10.1 C11.1 D3.1(K) D4.1(K) J27.1
N$65: C2P.1(+) J27.2 R6P.2
N$67: C4P.1(+) R2P.1 R3P.2 R4P.1 R5P.2
N$91 [L_Audio]: C24O.1(+) IC9.36(AOUTLP) J10.1
N$92 [L_Audio]: C26O.1(+) IC9.35(AOUTLN) J10.3
N$93 [R_Audio]: C15O.1(+) IC9.25(AOUTRP) J9.1
N$94 [R_Audio]: C25O.1(+) IC9.26(AOUTRN) J10.6
N$96: IC9.46(MCLK) J11.4 R4A.2
N$98: IC9.5(LRCK) J12.3 R3A.2
N$99: IC9.4(SDATA) J12.4 R2A.2
N$100: IC9.3(BICK) J12.5 R1A.2
N$102: C8A3.1 C9A.1(+) IC9.38(VCML) J11.7
N$103: C19B.1 IC5.7(SET) J17.4 R7B.1
N$104: IC1.4(PG) J15.1 R8A.2
N$108: C19C.1 IC4.7(SET) J16.4 R7C.1
N$109: IC4.6(PGFB) J16.3
N$110: IC4.5(ILIM) J16.2 R6C.1
N$111: IC1.5(ILIM) J15.2 R6A.1
N$112: IC7.6(PGFB) J19.3
N$113: IC4.4(PG) J16.1 R8C.2
N$114 [L_Audio]: C11O.1(+) IC3.36(AOUTLP) J2.1
N$115 [L_Audio]: C13O.1(+) IC3.35(AOUTLN) J2.3
N$116 [R_Audio]: C12O.1(+) IC3.25(AOUTRP) J1.1
N$117 [R_Audio]: C14O.1(+) IC3.26(AOUTRN) J2.6
N$118: C27A.1 C28A.1 IC9.1(DVDD) J12.7 LDO7.5(VOUT)
N$120: IC3.5(LRCK) J4.3 R3B.2
N$121: IC3.4(SDATA) J4.4 R2B.2
N$122: IC3.3(BICK) J4.5 R1B.2
N$124: C27B.1 C28B.1 IC3.1(DVDD) J4.7 LDO8.5(VOUT)
N$128: C12A2.1 C13B.1(+) IC3.23(VCMR) J1.2
N$130: DIF2.2 IC3.12(DIF2)
N$138: DIF2.3 IC3.14(INV) IC3.15(DEM0) IC3.17(ACKS) J1.5 ; supply symbol labelled +3V3
N$140: C12A3.1 C13A.1(+) IC9.23(VCMR) J9.2
N$142: DIF3.2 IC9.12(DIF2)
PDN: C1A.1 IC3.2(PDN) IC9.2(PDN) J4.6 J12.6 R5A.1 U$1.0-RX1(0-RX1/CRX2)
PE: IN.1
R+: R12O.1 R13O.1 R18O.1
R-: R14O.1 R16O.1 R27O.1
R_OUT: C21O.1 C23O.1 J26.3(RING) R3O.1 R17O.1
ROT_A: C6.1 U$1.3-LRCLK2 X1.1
ROT_B: C7.2 U$1.5-IN2 X1.3
ROT_LEDB: U$1.23-A9/CRX1/CCLK1(23-A9/CRX1/MCLK1) X1.4
ROT_LEDG: U$1.22-A8/CTX1 X1.5
ROT_LEDR: U$1.19-A5/SCL0 X1.6
ROT_SW: R1.2 U$1.4-BCLK2(4-BCLK1) X1.2
SCL0: IC3.8(SD) IC9.8(SD) J4.2 J12.2 R10.2 U$1.16-A2/RX4/SCL1 X4.1
SDA0: IC3.9(SLOW) IC9.9(SLOW) J4.1 J12.1 R20.2 U$1.17-A3/TX4/SDA1 X4.2
VCC: C1P1.1(+) C2.1 C2P1.1(+) C3P1.1(+) C4.1 C5P1.1(+) C20A.1 C20B.1 C20C.1 C20D.1 C20E.1 C20F.1 C21A.1 C21B.1 C21C.1 C21D.1 C21E.1 C21F.1 D7.1(K) D8.1(K) IC1.1(IN) IC1.2(IN) IC1.3(EN/UV) IC4.1(IN) IC4.2(IN) IC4.3(EN/UV) IC5.1(IN) IC5.2(IN) IC5.3(EN/UV) IC6.1(IN) IC6.2(IN) IC6.3(EN/UV) IC7.1(IN) IC7.2(IN) IC7.3(EN/UV) IC8.1(IN) IC8.2(IN) IC8.3(EN/UV) J15.7 J15.8 J16.7 J16.8 J17.7 J17.8 J18.7 J18.8 J19.7 J19.8 J20.7 J20.8 R8A.1 R8B.1 R8C.1 R8D.1 R8E.1 R8F.1 U1.3(INPUT)
Unconnected: BD1.H3.9 BD1.H3.18 BD1.H3.20 IC3.18(TESTE) IC9.18(TESTE) J3.1 J11.1 LDO7.4(NC) LDO8.4(NC) U$1.3V3-1 U$1.3V3-2 U$1.6-OUT1D U$1.7-RX2/OUT1A(7-OUT1A/RX2) U$1.8-TX2/IN1(8-IN1/TX2) U$1.9-OUT1C U$1.10-CS/MQSR(10-CS) U$1.11-MOSI/CTX1 U$1.12-MIO/MQSL(12-MISO/MQSL) U$1.13-SCK/CRX1/LED U$1.14-A0/TX3/S-PFI_OUT(14-A0/TX3/S-PDIF_IN) U$1.15-A1/RX3/S-PDIF_IN(15-A1/RX3/SPDIF_IN) U$1.18-A4/SDA0 U$1.20-A6/TX5/LRCLK1 U$1.21-A7/RX5/BCLK1 U$1.24-A10/TX6/SCL2 U$1.25-A11/SDA2(25-A11/RX6/SDA2) U$1.26-A12/MOSI1 U$1.27-A13/SCK1 U$1.28-RX7 U$1.29-TX7 U$1.30-CRX3 U$1.31-CTX3 U$1.32-OUTB1(32-OUT1B) U$1.33-MCLK2 U$1.ON/OFF U$1.PROGRAM U$1.VBAT

## Notes on the sheet
- SD LRCK DATA BICK PDN DVDD | SD LRCK DATA BICK PDN DVDD | SD LRCK DATA BICK PDN DVDD | SD LRCK DATA BICK PDN DVDD | SD LRCK DATA BICK PDN DVDD
- SD LRCK DATA BICK PDN DVDD
- +3.3V DGND MCLK AVDD VREFHL VCML | +3.3V DGND MCLK AVDD VREFHL VCML | +3.3V DGND MCLK AVDD VREFHL VCML | +3.3V DGND MCLK AVDD VREFHL VCML | +3.3V DGND MCLK AVDD VREFHL VCML | +3.3V DGND MCLK AVDD VREFHL VCML
- DIF0 DIF1 +3.3V VREFHR DGND VCMR | DIF0 DIF1 +3.3V VREFHR DGND VCMR | DIF0 DIF1 +3.3V VREFHR DGND VCMR | DIF0 DIF1 +3.3V VREFHR DGND VCMR | DIF0 DIF1 +3.3V VREFHR DGND VCMR | DIF0 DIF1 +3.3V VREFHR DGND VCMR
- DGND AORN VDDR VDDL AOLN DGND
- DGND AORN VDDR VDDL AOLN DGND
- DGND AORN VDDR VDDL AOLN DGND | DGND AORN VDDR VDDL AOLN DGND

## Library data of the parts
BD1 = Dual Mono Amp Library:I2SOVERUSBV3: Asynchronous audio transfer at sampling rates up to 768 kHz and 32 bit; BOM: Yes; DESCRIPTION: Asynchronous audio transfer at sampling rates up to 768 kHz and 32 bit
C1 = Dual Mono Amp Library:SR215C103KARTR1: AVX - SR215C103KARTR1 - Multilayer Ceramic Capacitor, 10000 pF, 50 V, SkyCap SR Series, +/- 10%, Radial Leaded, X7R Source: Datasheet <http://datasheets.avx.com/SR-Series.pdf>; DESCRIPTION: AVX - SR215C103KARTR1 - Multilayer Ceramic Capacitor, 10000 pF, 50 V, SkyCap SR Series, +/- 10%, Radial Leaded, X7R; HEIGHT: 5.08mm; MANUFACTURER_NAME: Kyocera AVX; MANUFACTURER_PART_NUMBER: SR215C103KARTR1; MOUSER_PART_NUMBER: 581-SR215C103KARTR1; MOUSER_PRICE-STOCK: https://www.mouser.co.uk/ProductDetail/KYOCERA-AVX/SR215C103KARTR1?qs=csK3ki7pNdubJvqBAL2rtA%3D%3D
C1A C6 C7 C21A C21B C21C C21D C21E C21F C22A C23A C24A C28A C28B = Dual Mono Amp Library:EMF212B7104KGHT: Multilayer Ceramic Capacitors MLCC - SMD/SMT 0805 16VDC 0.1uF 10% X7R AEC-Q200 Source: Datasheet <https://www.mouser.sg/ProductDetail/Taiyo-Yuden/EMF212B7104KGHT?qs=sGAEpiMZZMsh%2B1woXyUXj3/0vCYPokIk61QdMFnXOfA=>; DESCRIPTION: Multilayer Ceramic Capacitors MLCC - SMD/SMT 0805 16VDC 0.1uF 10% X7R AEC-Q200; HEIGHT: 1.35mm; MANUFACTURER_NAME: TAIYO YUDEN; MANUFACTURER_PART_NUMBER: EMF212B7104KGHT; MOUSER_PART_NUMBER: 963-EMF212B7104KGHT; MOUSER_PRICE-STOCK: https://www.mouser.co.uk/ProductDetail/Taiyo-Yuden/EMF212B7104KGHT?qs=%252B6g0mu59x7JRGtoE3odDgw%3D%3D
C1O C5O C6O C16O = Dual Mono Amp Library:MKP2C041001N00MN00: Film Capacitors MKP 2 1.0 uF 63 VDC 11x16x7.2 PCM 5 Source: Datasheet; DESCRIPTION: Film Capacitors MKP 2 1.0 uF 63 VDC 11x16x7.2 PCM 5; HEIGHT: 16mm; MANUFACTURER_NAME: WIMA; MANUFACTURER_PART_NUMBER: MKP2C041001N00MN00; MOUSER_PART_NUMBER: 505-MKP2C0411NMN; MOUSER_PRICE-STOCK: https://www.mouser.co.uk/ProductDetail/WIMA/MKP2C041001N00MN00?qs=RB4whv9F6rzjnMhXY4f0hA%3D%3D
C1P C2P C3P C5P C6P C7P C8P C9P C10P = Dual Mono Amp Library:500HXW68MEFR14.5X45: Aluminum Electrolytic Capacitors - Radial Leaded GENERAL PURPOSE ELECTROLYTIC CAPACITORS Source: Datasheet <https://www.mouser.com/datasheet/2/977/e_HXW-1600623.pdf>; DESCRIPTION: Aluminum Electrolytic Capacitors - Radial Leaded GENERAL PURPOSE ELECTROLYTIC CAPACITORS; HEIGHT: 47mm; MANUFACTURER_NAME: Rubycon; MANUFACTURER_PART_NUMBER: 500HXW68MEFR14.5X45
C1P1 C2P1 C3P1 C5P1 = Dual Mono Amp Library:35PX6800MEFC18X35.5: CAP ALUM 6800UF 20% 35V RADIAL Source: Datasheet <https://componentsearchengine.com/Datasheets/2/35PX6800MEFC18X35.5.pdf>; DESCRIPTION: CAP ALUM 6800UF 20% 35V RADIAL; HEIGHT: 37.5mm; MANUFACTURER_NAME: Rubycon; MANUFACTURER_PART_NUMBER: 35PX6800MEFC18X35.5; MOUSER_PART_NUMBER: 232-35PX6800MEFC18X5; MOUSER_PRICE-STOCK: https://www.mouser.co.uk/ProductDetail/Rubycon/35PX6800MEFC18X35.5?qs=T3oQrply3y%2FLQ%252BYVrZKbLg%3D%3D
C2-C5 = Dual Mono Amp Library:C322C104M5U5TA: GoldMax 300 Comm Z5U, Ceramic, 0.1 uF, 20%, 50 VDC, 125 VDC, 85C, 10C, Z5U, GoldMax, Commercial Standard, 4 % , 1 GOhms, 5.08mm, 6.6mm, 3.18mm, Lead Spacing = 5.08mm, 7mm, 0.51mm, 500, 20 Source: Datasheet <https://content.kemet.com/datasheets/KEM_C1051_GOLDMAX_Z5U.pdf>; DESCRIPTION: GoldMax 300 Comm Z5U, Ceramic, 0.1 uF, 20%, 50 VDC, 125 VDC, 85C, 10C, Z5U, GoldMax, Commercial Standard, 4 % , 1 GOhms, 5.08mm, 6.6mm, 3.18mm, Lead Spacing = 5.08mm, 7mm, 0.51mm, 500, 20; HEIGHT: 6.6mm; MANUFACTURER_NAME: KEMET; MANUFACTURER_PART_NUMBER: C322C104M5U5TA; MOUSER_PART_NUMBER: 80-C322C104M5U; MOUSER_PRICE-STOCK: https://www.mouser.co.uk/ProductDetail/KEMET/C322C104M5U5TA?qs=CDCeLP2tGBsLrnt3J6Fqow%3D%3D
C2A2 C2A3 C4A2 C4A3 C6A2 C6A3 C8A2 C8A3 C10A2 C10A3 C12A2 C12A3 C14A2 C14A3 C16A2 C16A3 = Dual Mono Amp Library:EMK107B7104KA-T: EMK107B7104KA-T 0.1F +/-10% 16V Ceramic Capacitor X7R 0603 Source: Datasheet; DESCRIPTION: EMK107B7104KA-T 0.1F +/-10% 16V Ceramic Capacitor X7R 0603; HEIGHT: 0.95mm; MANUFACTURER_NAME: TAIYO YUDEN; MANUFACTURER_PART_NUMBER: EMK107B7104KA-T; MOUSER_PART_NUMBER: 963-EMK107B7104KA-T; MOUSER_PRICE-STOCK: https://www.mouser.co.uk/ProductDetail/TAIYO-YUDEN/EMK107B7104KA-T?qs=I6KAKw0tg2ybqzX8hKPgfw%3D%3D
C2O C10O = Dual Mono Amp Library:MKS4B031002A00JC00: Film Capacitors MKS 4 0.1 uF 50 VDC 2.5x7x10 PCM 7.5 Source: Datasheet <https://www.wima.de/wp-content/uploads/media/e_WIMA_MKS_4.pdf>; DESCRIPTION: Film Capacitors MKS 4 0.1 uF 50 VDC 2.5x7x10 PCM 7.5; HEIGHT: 7mm; MANUFACTURER_NAME: WIMA; MANUFACTURER_PART_NUMBER: MKS4B031002A00JC00; MOUSER_PART_NUMBER: 505-MKS4B0312AJC; MOUSER_PRICE-STOCK: https://www.mouser.co.uk/ProductDetail/WIMA/MKS4B031002A00JC00?qs=2G4irm%2FqADy9MV8AUfKNYA%3D%3D
C3A C7A C9A C9B C13A C13B C15A C15B C17A C17B = Dual Mono Amp Library:RNU1A100MDSASQ: Aluminum Organic Polymer Capacitors 10 Volt 10uF 20% Source: Datasheet <https://www.nichicon.co.jp/products/pdfs/f_nu.pdf>; DESCRIPTION: Aluminum Organic Polymer Capacitors 10 Volt 10uF 20%; HEIGHT: 6mm; MANUFACTURER_NAME: Nichicon; MANUFACTURER_PART_NUMBER: RNU1A100MDSASQ; MOUSER_PART_NUMBER: 647-RNU1A100MDSASQ; MOUSER_PRICE-STOCK: https://www.mouser.co.uk/ProductDetail/Nichicon/RNU1A100MDSASQ?qs=eL6fcoQH66Plszdei%2FxZtw%3D%3D
C3B C5A C5B = Dual Mono Amp Library:A758BG106M1EAAE070: A758, Aluminum, Polymer Aluminum, 10 uF, 20%, 25 VDC, -55/+105C, 105C, -55C, 105C, 5,000 Hrs, 10 % , 70 mOhms, 120 uA, 5mm, 7mm, Lead Spacing = 2mm, 19mm, 1000 Source: Datasheet <https://content.kemet.com/datasheets/KEM_A4069_A758.pdf>; DESCRIPTION: A758, Aluminum, Polymer Aluminum, 10 uF, 20%, 25 VDC, -55/+105C, 105C, -55C, 105C, 5,000 Hrs, 10 % , 70 mOhms, 120 uA, 5mm, 7mm, Lead Spacing = 2mm, 19mm, 1000; HEIGHT: 8mm; MANUFACTURER_NAME: KEMET; MANUFACTURER_PART_NUMBER: A758BG106M1EAAE070; MOUSER_PART_NUMBER: 80-A758BG106M1EAAE70; MOUSER_PRICE-STOCK: https://www.mouser.co.uk/ProductDetail/KEMET/A758BG106M1EAAE070?qs=M6jHmRuQorU1WkHVIs6y3Q%3D%3D
C4O C18O = Dual Mono Amp Library:MKP4G034705D00KSSD: 0.47 F Film Capacitor 220V 400V Polypropylene (PP), Metallized Radial Source: Datasheet <https://www.wima.de/wp-content/uploads/media/e_WIMA_MKP_4.pdf>; DESCRIPTION: 0.47 F Film Capacitor 220V 400V Polypropylene (PP), Metallized Radial; HEIGHT: 16.5mm; MANUFACTURER_NAME: WIMA; MANUFACTURER_PART_NUMBER: MKP4G034705D00KSSD; MOUSER_PART_NUMBER: 505-MKP4G034705DKSSD; MOUSER_PRICE-STOCK: http://www.mouser.com/Search/ProductDetail.aspx?qs=sJjjjplDs9uaOctv9bTMfA%3d%3d
C4P = Dual Mono Amp Library:UCY2E220MPD1TD: Aluminum Electrolytic Capacitors - Radial Leaded 22uF 250V 20% AEC-Q200 Source: Datasheet <https://www.mouser.in/datasheet/2/293/e_ucy-3082387.pdf>; DESCRIPTION: Aluminum Electrolytic Capacitors - Radial Leaded 22uF 250V 20% AEC-Q200; HEIGHT: 17.5mm; MANUFACTURER_NAME: Nichicon; MANUFACTURER_PART_NUMBER: UCY2E220MPD1TD; MOUSER_PART_NUMBER: 647-UCY2E220MPD1TD; MOUSER_PRICE-STOCK: https://www.mouser.co.uk/ProductDetail/Nichicon/UCY2E220MPD1TD?qs=JgOBn5pVFooNXIGMeLbPFg%3D%3D
C7B C11A C11B = Dual Mono Amp Library:APSG160ELL222MJ20S: Aluminum Organic Polymer Capacitors 16V 2200uF 20% Tol. Source: Datasheet <https://www.chemi-con.co.jp/products/relatedfiles/capacitor/catalog/PSGLL-e.PDF>; DESCRIPTION: Aluminum Organic Polymer Capacitors 16V 2200uF 20% Tol.; HEIGHT: 21.5mm; MANUFACTURER_NAME: Chemi-Con; MANUFACTURER_PART_NUMBER: APSG160ELL222MJ20S; MOUSER_PART_NUMBER: 661-APSG160E222MJ20S; MOUSER_PRICE-STOCK: https://www.mouser.co.uk/ProductDetail/United-Chemi-Con/APSG160ELL222MJ20S?qs=nxZbHzLpdvcUAIXRVD5aZg%3D%3D
C7O C21O = Dual Mono Amp Library:DCP4G053006ID2KSSD: Film Capacitors DC-LINK MKP 4 30.0 uF 400 VDC 17x34.5x31.5 PCM 27.5 Source: Datasheet <https://www.wima.de/wp-content/uploads/media/e_WIMA_DC_Link_MKP_4.pdf>; DESCRIPTION: Film Capacitors DC-LINK MKP 4 30.0 uF 400 VDC 17x34.5x31.5 PCM 27.5; HEIGHT: 34.5mm; MANUFACTURER_NAME: WIMA; MANUFACTURER_PART_NUMBER: DCP4G053006ID2KSSD; MOUSER_PART_NUMBER: 505-DCP4G0536ID2KSSD; MOUSER_PRICE-STOCK: https://www.mouser.co.uk/ProductDetail/WIMA/DCP4G053006ID2KSSD?qs=RB4whv9F6rwxZ2Ey0tRejg%3D%3D
C8 = Dual Mono Amp Library:C322C103KDR5TA: GoldMax 300 Comm X7R HV, Ceramic, 0.01 uF, 10%, 1000 VDC, 1200 VDC, 125C, -55C, X7R, GoldMax, Commercial Standard, 2.5 % , 100 GOhms, 5.08mm, 6.6mm, 3.81mm, Lead Spacing = 5.08mm, 7mm, 0.51mm, 500, 80 Source: Datasheet <https://content.kemet.com/datasheets/KEM_C1055_HIVOLT_GOLDMAX_300_X7R.pdf>; DESCRIPTION: GoldMax 300 Comm X7R HV, Ceramic, 0.01 uF, 10%, 1000 VDC, 1200 VDC, 125C, -55C, X7R, GoldMax, Commercial Standard, 2.5 % , 100 GOhms, 5.08mm, 6.6mm, 3.81mm, Lead Spacing = 5.08mm, 7mm, 0.51mm, 500, 80; HEIGHT: 6mm; MANUFACTURER_NAME: KEMET; MANUFACTURER_PART_NUMBER: C322C103KDR5TA; MOUSER_PART_NUMBER: 80-C322C103KDR; MOUSER_PRICE-STOCK: https://www.mouser.co.uk/ProductDetail/KEMET/C322C103KDR5TA?qs=zULuPd4qeXmo%2FZ2rvtU3CA%3D%3D
C9-C12 = Dual Mono Amp Library:C330C104KDR5TA: GoldMax 300 Comm X7R HV, Ceramic, 0.1 uF, 10%, 1000 VDC, 1200 VDC, 125C, -55C, X7R, GoldMax, Commercial Standard, 2.5 % , 10 GOhms, 7.62mm, 9.14mm, 5.08mm, Lead Spacing = 5.08mm, 7mm, 0.51mm, 250, 80 Source: Datasheet <https://content.kemet.com/datasheets/KEM_C1055_HIVOLT_GOLDMAX_300_X7R.pdf>; DESCRIPTION: GoldMax 300 Comm X7R HV, Ceramic, 0.1 uF, 10%, 1000 VDC, 1200 VDC, 125C, -55C, X7R, GoldMax, Commercial Standard, 2.5 % , 10 GOhms, 7.62mm, 9.14mm, 5.08mm, Lead Spacing = 5.08mm, 7mm, 0.51mm, 250, 80; HEIGHT: 9.14mm; MANUFACTURER_NAME: KEMET; MANUFACTURER_PART_NUMBER: C330C104KDR5TA; MOUSER_PART_NUMBER: 80-C330C104KDR; MOUSER_PRICE-STOCK: https://www.mouser.co.uk/ProductDetail/KEMET/C330C104KDR5TA?qs=zEQ6BYqA5vFyuV6ad%252B2aNA%3D%3D
C9O C23O = Dual Mono Amp Library:MKP4G041005I00JSSD: Film Capacitors 1uF 400 Volts 5% Source: Datasheet <https://www.wima.de/wp-content/uploads/media/e_WIMA_MKP_4.pdf>; DESCRIPTION: Film Capacitors 1uF 400 Volts 5%; HEIGHT: 21mm; MANUFACTURER_NAME: WIMA; MANUFACTURER_PART_NUMBER: MKP4G041005I00JSSD; MOUSER_PART_NUMBER: 505-MKP4G041005I00JS; MOUSER_PRICE-STOCK: https://www.mouser.co.uk/ProductDetail/WIMA/MKP4G041005I00JSSD?qs=JZ%252BiKJYxjZXJVyWNRtSklQ%3D%3D
C11O C12O C13O C14O C15O C24O C25O C26O = Dual Mono Amp Library:UFW1H101MPD1TD: Aluminum Electrolytic Capacitors - Radial Leaded 100uF 50 Volts 20% Source: Datasheet <https://www.nichicon.co.jp/english/series_items/catalog_pdf/e-ufw.pdf>; ARROW_PART_NUMBER: UFW1H101MPD1TD; ARROW_PRICE-STOCK: https://www.arrow.com/en/products/ufw1h101mpd1td/nichicon; DESCRIPTION: Aluminum Electrolytic Capacitors - Radial Leaded 100uF 50 Volts 20%; HEIGHT: 13mm; MANUFACTURER_NAME: Nichicon; MANUFACTURER_PART_NUMBER: UFW1H101MPD1TD; MOUSER_PART_NUMBER: 647-UFW1H101MPD1TD; MOUSER_PRICE-STOCK: https://www.mouser.co.uk/ProductDetail/Nichicon/UFW1H101MPD1TD?qs=WJSLByB5Mu30jPPJ2KiG3A%3D%3D
C18A C18B C18C C18D C18E C18F C26A C26B C27A C27B = Dual Mono Amp Library:EMK212ABJ475KG-T: Taiyo Yuden 4.7uF Multilayer Ceramic Capacitor MLCC 16V dc +/-10% X5R Dielectric 0805 SMD, Max. Temp. +85C Source: Datasheet <https://datasheet.datasheetarchive.com/originals/distributors/DKDS-8/141347.pdf>; DESCRIPTION: Taiyo Yuden 4.7uF Multilayer Ceramic Capacitor MLCC 16V dc +/-10% X5R Dielectric 0805 SMD, Max. Temp. +85C; HEIGHT: 1.4mm; MANUFACTURER_NAME: TAIYO YUDEN; MANUFACTURER_PART_NUMBER: EMK212ABJ475KG-T; MOUSER_PART_NUMBER: 963-EMK212ABJ475KG-T; MOUSER_PRICE-STOCK: https://www.mouser.co.uk/ProductDetail/Taiyo-Yuden/EMK212ABJ475KG-T?qs=Va%252BXcMGJzEtDqSLhA2RQmA%3D%3D
C19A C19B C19C C19D C19E C19F = Dual Mono Amp Library:EMK316BB7226ML-T: Multilayer Ceramic Capacitors MLCC - SMD/SMT 22uF 16V X7R +/-20% 1206 Gen Purp Source: Datasheet <https://componentsearchengine.com/Datasheets/1/EMK316BB7226ML-T.pdf>; DESCRIPTION: Multilayer Ceramic Capacitors MLCC - SMD/SMT 22uF 16V X7R +/-20% 1206 Gen Purp; HEIGHT: 1.8mm; MANUFACTURER_NAME: TAIYO YUDEN; MANUFACTURER_PART_NUMBER: EMK316BB7226ML-T; MOUSER_PART_NUMBER: 963-EMK316BB7226ML-T; MOUSER_PRICE-STOCK: https://www.mouser.co.uk/ProductDetail/TAIYO-YUDEN/EMK316BB7226ML-T?qs=EPmvyOv1YlPvyo1ebMxtFg%3D%3D
C20A C20B C20C C20D C20E C20F = Dual Mono Amp Library:EMK212BB7106KG-T: Multilayer Ceramic Capacitors MLCC - SMD/SMT 10uF 16V X7R 10% 0805 Source: Datasheet; DESCRIPTION: Multilayer Ceramic Capacitors MLCC - SMD/SMT 10uF 16V X7R 10% 0805; HEIGHT: 1.35mm; MANUFACTURER_NAME: TAIYO YUDEN; MANUFACTURER_PART_NUMBER: EMK212BB7106KG-T; MOUSER_PART_NUMBER: 963-EMK212BB7106KG-T; MOUSER_PRICE-STOCK: https://www.mouser.co.uk/ProductDetail/TAIYO-YUDEN/EMK212BB7106KG-T?qs=vF%252B8ahGVilemLVRka0hELA%3D%3D
D1-D8 = Dual Mono Amp Library:1N4007FFG: Rectifiers 1000V 1A Standard Source: Datasheet <http://www.onsemi.com/pub_link/Collateral/1N4001-D.PDF>; DESCRIPTION: Rectifiers 1000V 1A Standard; HEIGHT: mm; MANUFACTURER_NAME: onsemi; MANUFACTURER_PART_NUMBER: 1N4007FFG; MOUSER_PART_NUMBER: 863-1N4007FFG; MOUSER_PRICE-STOCK: https://www.mouser.co.uk/ProductDetail/onsemi/1N4007FFG?qs=y2kkmE52mdPFE87Rxbyfgw%3D%3D
D9 = Dual Mono Amp Library:SS14_R2_00001: Schottky Diodes & Rectifiers SURFACE MOUNT SCHOTTKY BARRIER RECTIFIER Source: Datasheet <https://www.mouser.tw/datasheet/2/1057/SS12_SERIES-1877093.pdf>; DESCRIPTION: Schottky Diodes & Rectifiers SURFACE MOUNT SCHOTTKY BARRIER RECTIFIER; HEIGHT: 2.44mm; MANUFACTURER_NAME: PANJIT; MANUFACTURER_PART_NUMBER: SS14_R2_00001; MOUSER_PART_NUMBER: 241-SS14_R2_00001; MOUSER_PRICE-STOCK: https://www.mouser.co.uk/ProductDetail/Panjit/SS14_R2_00001?qs=sPbYRqrBIVldvh3JHWJPNg%3D%3D
DIF2 DIF3 = Dual Mono Amp Library:SJ2W: SMD solder JUMPER
IC1 IC4-IC8 = Dual Mono Amp Library:LT3042: LINEAR TECHNOLOGY - LT3042EMSE#PBF - LDO, ADJ, 0.2A, 0V-15V, MSOP-10 Source: Datasheet <http://www.linear.com/docs/46159>; DESCRIPTION: LINEAR TECHNOLOGY - LT3042EMSE#PBF - LDO, ADJ, 0.2A, 0V-15V, MSOP-10; HEIGHT: 1.1mm; MANUFACTURER_NAME: Linear Technology; MANUFACTURER_PART_NUMBER: LT3042EMSE#PBF; MOUSER_PART_NUMBER: 584-LT3042EMSE#PBF; MOUSER_PRICE-STOCK: https://www.mouser.co.uk/ProductDetail/Analog-Devices-Linear-Technology/LT3042EMSEPBF?qs=oahfZPh6IAJ3XP16d20ITw%3D%3D
IC3 IC9 = Dual Mono Amp Library:AK4493: Quality Oriented 32-Bit 2ch DAC 32-Bit, 768 kHz with VELVET SOUND
IC4A = Dual Mono Amp Library:SN74ABT273DBR: Octal Edge-Triggered D-Type Flip-Flops With Clear Source: Datasheet <http://www.ti.com/lit/gpn/sn74abt273>; DESCRIPTION: Octal Edge-Triggered D-Type Flip-Flops With Clear; HEIGHT: 2mm; MANUFACTURER_NAME: Texas Instruments; MANUFACTURER_PART_NUMBER: SN74ABT273DBR; MOUSER_PART_NUMBER: 595-SN74ABT273DBR; MOUSER_PRICE-STOCK: https://www.mouser.co.uk/ProductDetail/Texas-Instruments/SN74ABT273DBR?qs=X1HXWTtiZ0RWq%2Fv0JNOEpw%3D%3D
IN = Dual Mono Amp Library:1935213: Fixed Terminal Blocks PT 1.5/7-5.0-H Source: Datasheet <https://datasheet.datasheetarchive.com/originals/distributors/SFDatasheet-2/sf-00057464.pdf>; DESCRIPTION: Fixed Terminal Blocks PT 1.5/7-5.0-H; HEIGHT: 11.55mm; MANUFACTURER_NAME: Phoenix Contact; MANUFACTURER_PART_NUMBER: 1935213; MOUSER_PART_NUMBER: 651-1935213; MOUSER_PRICE-STOCK: https://www.mouser.co.uk/ProductDetail/Phoenix-Contact/1935213?qs=wd%252Bw3mUqFrnK4kINj%2Fk1Qg%3D%3D
J1-J4 J9-J12 = Dual Mono Amp Library:CONN_07: Multi connection point. Often used as Generic Header-pin footprint for 0.1 inch spaced/style header connections On any of the 0.1 inch spaced packages, you can populate with these: Break Away Headers - Straight <https://www.sparkfun.com/products/116> (PRT-00116) Break Away Male Headers - Right Angle <https://www.sparkfun.com/products/553> (PRT-00553) Female Headers <https://www.sparkfun.com/products/115> (PRT-00115) Break Away Headers - Machine Pin <https://www.sparkfun.com/products/117> (PRT-00117) Break Away Female Headers - Swiss Machine Pin <https://www.sparkfun.com/products/743> (PRT-00743) For SCREWTERMINALS and SPRING TERMINALS visit here: Screw Terimnals on SparkFun.com <https://www.sparkfun.com/search/results?term=Screw+Terminals> (5mm/3.5mm/2.54mm spacing) This device is also useful as a general connection point to wire up your design to another part of your project. Our various solder wires solder well into these plated through hole pads. Hook-Up Wire - Assortment (Stranded, 22 AWG) <https://www.sparkfun.com/products/11375> (PRT-11375) Hook-Up Wire - Assortment (Solid Core, 22 AWG) <https://www.sparkfun.com/products/11367> (PRT-11367) View the entire wire category on our website here <https://www.sparkfun.com/categories/141> Special notes: Molex polarized connector foot print use with SKU : PRT-08231 with associated crimp pins and housings. 1MM SMD Version SKU: PRT-10208 NOTES ON THE VARIANTS LOCK and LOCK_LONGPADS... This footprint was designed to help hold the alignment of a through-hole component (i.e. 6-pin header) while soldering it into place. You may notice that each hole has been shifted either up or down by 0.005 of an inch from it's more standard position (which is a perfectly straight line). This slight alteration caused the pins (the squares in the middle) to touch the edges of the holes. Because they are alternating, it causes a "brace" to hold the component in place. 0.005 has proven to be the perfect amount of "off-center" position when using our standard breakaway headers. Although looks a little odd when you look at the bare footprint, once you have a header in there, the alteration is very hard to notice. Also,if you push a header all the way into place, it is covered up entirely on the bottom side.; PROD_ID: Combine 8288+14485
J15-J20 = Dual Mono Amp Library:XR2A-0811-N: IC & Component Sockets Socket DIP Term 8P 7.62mm .25AuPlate Source: Datasheet <https://omronfs.omron.com/en_US/ecb/products/pdf/en-xr2.pdf>; ARROW_PART_NUMBER: XR2A-0811-N; ARROW_PRICE-STOCK: https://www.arrow.com/en/products/xr2a-0811-n/omron?region=nac; DESCRIPTION: IC & Component Sockets Socket DIP Term 8P 7.62mm .25AuPlate; HEIGHT: 3.9mm; MANUFACTURER_NAME: Omron Electronics; MANUFACTURER_PART_NUMBER: XR2A-0811-N; MOUSER_PART_NUMBER: 653-XR2A-0811-N; MOUSER_PRICE-STOCK: https://www.mouser.co.uk/ProductDetail/Omron-Electronics/XR2A-0811-N?qs=WOBxwZpV8jWLu7CcbwkK0Q%3D%3D
J21 J22 = Dual Mono Amp Library:CONN_10: Multi connection point. Often used as Generic Header-pin footprint for 0.1 inch spaced/style header connections On any of the 0.1 inch spaced packages, you can populate with these: Break Away Headers - Straight <https://www.sparkfun.com/products/116> (PRT-00116) Break Away Male Headers - Right Angle <https://www.sparkfun.com/products/553> (PRT-00553) Female Headers <https://www.sparkfun.com/products/115> (PRT-00115) Break Away Headers - Machine Pin <https://www.sparkfun.com/products/117> (PRT-00117) Break Away Female Headers - Swiss Machine Pin <https://www.sparkfun.com/products/743> (PRT-00743) Arduino Stackable Header - 10 Pin <https://www.sparkfun.com/products/11376> (PRT-11376) For SCREWTERMINALS and SPRING TERMINALS visit here: Screw Terimnals on SparkFun.com <https://www.sparkfun.com/search/results?term=Screw+Terminals> (5mm/3.5mm/2.54mm spacing) This device is also useful as a general connection point to wire up your design to another part of your project. Our various solder wires solder well into these plated through hole pads. Hook-Up Wire - Assortment (Stranded, 22 AWG) <https://www.sparkfun.com/products/11375> (PRT-11375) Hook-Up Wire - Assortment (Solid Core, 22 AWG) <https://www.sparkfun.com/products/11367> (PRT-11367) View the entire wire category on our website here <https://www.sparkfun.com/categories/141> Special notes: Molex polarized connector foot print use with SKU : PRT-08231 with associated crimp pins and housings. 1MM SMD Version SKU: PRT-10208 NOTES ON THE VARIANTS LOCK and LOCK_LONGPADS... This footprint was designed to help hold the alignment of a through-hole component (i.e. 6-pin header) while soldering it into place. You may notice that each hole has been shifted either up or down by 0.005 of an inch from it's more standard position (which is a perfectly straight line). This slight alteration caused the pins (the squares in the middle) to touch the edges of the holes. Because they are alternating, it causes a "brace" to hold the component in place. 0.005 has proven to be the perfect amount of "off-center" position when using our standard breakaway headers. Although looks a little odd when you look at the bare footprint, once you have a header in there, the alteration is very hard to notice. Also,if you push a header all the way into place, it is covered up entirely on the bottom side.; PROD_ID: CONN-11563
J26 = Dual Mono Amp Library:SJ-63033A: 6.35 mm, Stereo, Right Angle, Through Hole Mount, 3 Conductors, 0 Internal Switches, Audio Jack Connector Source: Datasheet <https://www.cuidevices.com/product/resource/sj-63033a.pdf>; DESCRIPTION: 6.35 mm, Stereo, Right Angle, Through Hole Mount, 3 Conductors, 0 Internal Switches, Audio Jack Connector; HEIGHT: 12.3mm; MANUFACTURER_NAME: CUI Devices; MANUFACTURER_PART_NUMBER: SJ-63033A
J27 = Dual Mono Amp Library:1935161: Phoenix Contact COMBICON PT PCB Terminal Block, 2 Way/Pole, Screw Terminals, 26 14 AWG Through Hole, Nylon Source: Datasheet <https://datasheet.datasheetarchive.com/originals/distributors/SFDatasheet-2/sf-00057459.pdf>; DESCRIPTION: Phoenix Contact COMBICON PT PCB Terminal Block, 2 Way/Pole, Screw Terminals, 26 14 AWG Through Hole, Nylon; HEIGHT: 11.55mm; MANUFACTURER_NAME: Phoenix Contact; MANUFACTURER_PART_NUMBER: 1935161; MOUSER_PART_NUMBER: 651-1935161; MOUSER_PRICE-STOCK: https://www.mouser.co.uk/ProductDetail/Phoenix-Contact/1935161?qs=W3wJikR1%252BS6eKzfFl8Rbew%3D%3D
LDO7 LDO8 = Dual Mono Amp Library:LP5907-1.8V: 250-mA ultra-low-noise low-IQ low-dropout (LDO) linear regulator Source: Datasheet <http://www.ti.com/lit/gpn/lp5907>; ARROW_PART_NUMBER: LP5907MFX-1.8/NOPB; ARROW_PRICE-STOCK: https://www.arrow.com/en/products/lp5907mfx-1.8nopb/texas-instruments?region=nac; DESCRIPTION: 250-mA ultra-low-noise low-IQ low-dropout (LDO) linear regulator; HEIGHT: 1.45mm; MANUFACTURER_NAME: Texas Instruments; MANUFACTURER_PART_NUMBER: LP5907MFX-1.8/NOPB; MOUSER_PART_NUMBER: 595-LP5907MFX-1.8NPB; MOUSER_PRICE-STOCK: https://www.mouser.co.uk/ProductDetail/Texas-Instruments/LP5907MFX-1.8-NOPB?qs=biyDIajrTn5jh5ArkSZeqw%3D%3D
R1 = Dual Mono Amp Library:ERJ-P06J512V: Thick Film Resistors - SMD 0805 5.1Kohms 0.5W 5% AEC-Q200 Source: Datasheet <http://industrial.panasonic.com/cdbs/www-data/pdf/RDA0000/AOA0000C102.pdf>; DESCRIPTION: Thick Film Resistors - SMD 0805 5.1Kohms 0.5W 5% AEC-Q200; HEIGHT: 0.7mm; MANUFACTURER_NAME: Panasonic; MANUFACTURER_PART_NUMBER: ERJ-P06J512V; MOUSER_PART_NUMBER: 667-ERJ-P06J512V; MOUSER_PRICE-STOCK: https://www.mouser.co.uk/ProductDetail/Panasonic/ERJ-P06J512V?qs=Zyl8A9hlmJpKp56GwTQkVA%3D%3D
R1A R1B R2A R2B R3A R3B R4A R4B = Dual Mono Amp Library:RT0603DRE075R1L: Thin Film Resistors - SMD 1/10W 5.1 ohm .5% 50ppm Source: Datasheet <https://www.mouser.com/datasheet/2/447/PYu_RT_1_to_0_01_RoHS_L_12-3003070.pdf>; DESCRIPTION: Thin Film Resistors - SMD 1/10W 5.1 ohm .5% 50ppm; HEIGHT: 0.55mm; MANUFACTURER_NAME: YAGEO; MANUFACTURER_PART_NUMBER: RT0603DRE075R1L
R1O R2O R4O R6O R13O R15O R17O R27O = Dual Mono Amp Library:LR1F47K: TE Connectivity LR1F Series Axial Metal Film Resistor 47k +/-1% 0.6W +/-50ppm/C Source: Datasheet <https://componentsearchengine.com/Datasheets/2/LR1F47K.pdf>; DESCRIPTION: TE Connectivity LR1F Series Axial Metal Film Resistor 47k +/-1% 0.6W +/-50ppm/C; HEIGHT: mm; MANUFACTURER_NAME: TE Connectivity; MANUFACTURER_PART_NUMBER: LR1F47K; MOUSER_PART_NUMBER: 279-LR1F47K; MOUSER_PRICE-STOCK: https://www.mouser.co.uk/ProductDetail/TE-Connectivity-Holsworthy/LR1F47K?qs=ip69W3eHERWQ8q3y81tH5w%3D%3D
R2P R3P = Dual Mono Amp Library:PR02000202200JA100: Vishay PR02 Series Axial Metal Film Fixed Resistor 220 +/-5% 2W +/-250ppm/C Source: Datasheet <https://componentsearchengine.com/Datasheets/2/PR02000203300JA100.pdf>; DESCRIPTION: Vishay PR02 Series Axial Metal Film Fixed Resistor 220 +/-5% 2W +/-250ppm/C; HEIGHT: mm; MANUFACTURER_NAME: Vishay; MANUFACTURER_PART_NUMBER: PR02000202200JA100; MOUSER_PART_NUMBER: 594-5083NW220R0JA100; MOUSER_PRICE-STOCK: https://www.mouser.com/ProductDetail/594-5083NW220R0JA100
R3O R7O = Dual Mono Amp Library:LR1F1M0: TE Connectivity Axial Metal Film Resistor 1m +/-1% 0.6W +/-50ppm/C Source: Datasheet <https://www.te.com/commerce/DocumentDelivery/DDEController?Action=showdoc&DocId=Data Sheet1773241GpdfEnglishENG_DS_1773241_G.pdf1622367-1>; DESCRIPTION: TE Connectivity Axial Metal Film Resistor 1m +/-1% 0.6W +/-50ppm/C; HEIGHT: mm; MANUFACTURER_NAME: TE Connectivity; MANUFACTURER_PART_NUMBER: LR1F1M0; MOUSER_PART_NUMBER: 279-LR1F1M0; MOUSER_PRICE-STOCK: https://www.mouser.co.uk/ProductDetail/TE-Connectivity-Holsworthy/LR1F1M0?qs=ip69W3eHERVt%2FmQVAugcSg%3D%3D
R4P = Dual Mono Amp Library:PR02000203003JR500: Vishay PR0200 Series Axial Metal Film Fixed Resistor 300k +/-5% 2W +/-250ppm/K Source: Datasheet <https://componentsearchengine.com/Datasheets/1/PR02000203003JR500.pdf>; DESCRIPTION: Vishay PR0200 Series Axial Metal Film Fixed Resistor 300k +/-5% 2W +/-250ppm/K; HEIGHT: mm; MANUFACTURER_NAME: Vishay; MANUFACTURER_PART_NUMBER: PR02000203003JR500; MOUSER_PART_NUMBER: 594-5083NW300K0J; MOUSER_PRICE-STOCK: https://www.mouser.co.uk/ProductDetail/Vishay-BC-Components/PR02000203003JR500?qs=LCMWAU1DZcy5bcFmrSgb2A%3D%3D
R5A = Dual Mono Amp Library:RCS080510K0FKEA: Res Thick Film 0805 10K Ohm 1% 0.4W +/-100ppm/C Pad SMD Automotive T/R Source: Datasheet <https://componentsearchengine.com/Datasheets/1/RCS080510K0FKEA.pdf>; DESCRIPTION: Res Thick Film 0805 10K Ohm 1% 0.4W +/-100ppm/C Pad SMD Automotive T/R; HEIGHT: 0.5mm; MANUFACTURER_NAME: Vishay; MANUFACTURER_PART_NUMBER: RCS080510K0FKEA; MOUSER_PART_NUMBER: 71-RCS080510K0FKEA; MOUSER_PRICE-STOCK: https://www.mouser.com/Search/Refine.aspx?Keyword=71-RCS080510K0FKEA
R5O R8O R9O R10O = Dual Mono Amp Library:LR1F150R: TE Connectivity LR1F Series Axial Metal Film Resistor 150 +/-1% 0.6W +/-50ppm/C Source: Datasheet <https://datasheet.datasheetarchive.com/originals/distributors/DKDS-21/401716.pdf>; DESCRIPTION: TE Connectivity LR1F Series Axial Metal Film Resistor 150 +/-1% 0.6W +/-50ppm/C; HEIGHT: mm; MANUFACTURER_NAME: TE Connectivity; MANUFACTURER_PART_NUMBER: LR1F150R
R5P = Dual Mono Amp Library:PR02000201003JA100: Vishay PR02 Series Axial Metal Film Fixed Resistor 100k +/-5% 2W +/-250ppm/C Source: Datasheet <http://www.vishay.com/docs/28729/pr010203.pdf>; DESCRIPTION: Vishay PR02 Series Axial Metal Film Fixed Resistor 100k +/-5% 2W +/-250ppm/C; HEIGHT: mm; MANUFACTURER_NAME: Vishay; MANUFACTURER_PART_NUMBER: PR02000201003JA100; MOUSER_PART_NUMBER: 594-5083NW100K0JA100; MOUSER_PRICE-STOCK: https://www.mouser.co.uk/ProductDetail/Vishay-BC-Components/PR02000201003JA100?qs=T%2FnZg7%2FCwxPef%2F94FLP9PA%3D%3D
R6A R6B R6C R6D R6E R6F = Dual Mono Amp Library:CHP0805-FX-1001ELF: BOURNS - CHP0805-FX-1001ELF - SMD Chip Resistor, 0805 [2012 Metric], 1 kohm, CHP Series, 200 V, Thick Film, 500 mW Source: Datasheet <https://www.bourns.com/docs/product-datasheets/chp.pdf>; DESCRIPTION: BOURNS - CHP0805-FX-1001ELF - SMD Chip Resistor, 0805 [2012 Metric], 1 kohm, CHP Series, 200 V, Thick Film, 500 mW; HEIGHT: 0.6mm; MANUFACTURER_NAME: Bourns; MANUFACTURER_PART_NUMBER: CHP0805-FX-1001ELF; MOUSER_PART_NUMBER: 652-CHP0805FX1001ELF; MOUSER_PRICE-STOCK: https://www.mouser.co.uk/ProductDetail/Bourns/CHP0805-FX-1001ELF?qs=lc2O%252BfHJPVYkHmuBCgSoNQ%3D%3D
R6P = Dual Mono Amp Library:PR02000203300JA100: Vishay PR02 Series Axial Metal Film Fixed Resistor 330 +/-5% 2W +/-250ppm/C Source: Datasheet <https://componentsearchengine.com/Datasheets/2/PR02000203300JA100.pdf>; DESCRIPTION: Vishay PR02 Series Axial Metal Film Fixed Resistor 330 +/-5% 2W +/-250ppm/C; HEIGHT: mm; MANUFACTURER_NAME: Vishay; MANUFACTURER_PART_NUMBER: PR02000203300JA100; MOUSER_PART_NUMBER: 594-5083NW330R0JA100; MOUSER_PRICE-STOCK: https://www.mouser.co.uk/ProductDetail/Vishay-BC-Components/PR02000203300JA100?qs=Dh5jukcGX2ziou5E5xaogg%3D%3D
R7A R7B R7C R7D R7E R7F = Dual Mono Amp Library:CPF0805B51KE1: NEOHM - TE CONNECTIVITY - CPF0805B51KE1 - SMD Chip Resistor, 51 kohm, +/- 0.1%, 100 mW, 0805 [2012 Metric], Thin Film, Precision Low TCR Source: Datasheet; DESCRIPTION: NEOHM - TE CONNECTIVITY - CPF0805B51KE1 - SMD Chip Resistor, 51 kohm, +/- 0.1%, 100 mW, 0805 [2012 Metric], Thin Film, Precision Low TCR; HEIGHT: 0.65mm; MANUFACTURER_NAME: TE Connectivity; MANUFACTURER_PART_NUMBER: CPF0805B51KE1; MOUSER_PART_NUMBER: 279-CPF0805B51KE1; MOUSER_PRICE-STOCK: https://www.mouser.co.uk/ProductDetail/TE-Connectivity-Holsworthy/CPF0805B51KE1?qs=iJVBkmKXgrkfOCLIw017vA%3D%3D
R8A R8B R8C R8D R8E R8F = Dual Mono Amp Library:RR1220P-204-D: RESISTOR, 0805 200 KOhm +/- 0.5% 0.1 W Source: Datasheet <https://componentsearchengine.com/Datasheets/1/RR1220P-204-D.pdf>; DESCRIPTION: RESISTOR, 0805 200 KOhm +/- 0.5% 0.1 W; HEIGHT: mm; MANUFACTURER_NAME: Susumu; MANUFACTURER_PART_NUMBER: RR1220P-204-D; MOUSER_PART_NUMBER: 754-RR1220P-204D; MOUSER_PRICE-STOCK: https://www.mouser.com/Search/Refine.aspx?Keyword=754-RR1220P-204D
R10 R20 = Dual Mono Amp Library:RCS08052K20FKEA: Res Thick Film 0805 2.2K Ohm 1% 0.4W +/-100ppm/C Conformal Coated Pad SMD T/R Source: Datasheet <https://componentsearchengine.com/Datasheets/1/RCS08052K20FKEA.pdf>; DESCRIPTION: Res Thick Film 0805 2.2K Ohm 1% 0.4W +/-100ppm/C Conformal Coated Pad SMD T/R; HEIGHT: mm; MANUFACTURER_NAME: Vishay; MANUFACTURER_PART_NUMBER: RCS08052K20FKEA; MOUSER_PART_NUMBER: 71-RCS08052K20FKEA; MOUSER_PRICE-STOCK: https://www.mouser.com/Search/Refine.aspx?Keyword=71-RCS08052K20FKEA
R11O R19O R20O R21O R22O R28O R29O R30O = Dual Mono Amp Library:LR1F10K: Metal film resistor, 10K 0.6W TE Connectivity LR1F Series Axial Metal Film Resistor 10k Source: Datasheet <https://datasheet.datasheetarchive.com/originals/distributors/DKDS-21/401716.pdf>; DESCRIPTION: Metal film resistor, 10K 0.6W TE Connectivity LR1F Series Axial Metal Film Resistor 10k; HEIGHT: mm; MANUFACTURER_NAME: TE Connectivity; MANUFACTURER_PART_NUMBER: LR1F10K; MOUSER_PART_NUMBER: 279-LR1F10K; MOUSER_PRICE-STOCK: https://www.mouser.co.uk/ProductDetail/TE-Connectivity-Holsworthy/LR1F10K?qs=ip69W3eHERWDLLWs2Qv0Lg%3D%3D
R12O R14O R16O R18O R23O R24O R25O R26O = Dual Mono Amp Library:MF0207FTE52-182R: Metal Film Resistors - Through Hole 0.6W 1% 182 ohm 50pp m Source: Datasheet <https://www.mouser.com/datasheet/2/447/YAGEO_MF0_datasheet_2021v1-3003020.pdf>; DESCRIPTION: Metal Film Resistors - Through Hole 0.6W 1% 182 ohm 50pp m; HEIGHT: mm; MANUFACTURER_NAME: YAGEO; MANUFACTURER_PART_NUMBER: MF0207FTE52-182R
R21A = Dual Mono Amp Library:R-POL: RESISTOR, American symbol; SPICEPREFIX: R
SH3 = Dual Mono Amp Library:SHORT: Short between two nets; BOM: No; DESCRIPTION: Short between two nets
SX1 SX2 = Dual Mono Amp Library:VT9: VACUUM TUBE SOCKET Source: 00004280-VT9-PT.pdf
U1 = Dual Mono Amp Library:AZ1117H-5.0TRE1: 1A 5V LDO Linear Voltage Reg SOT-223 Diodes Inc AZ1117H-5.0TRE1, Single Linear Voltage Regulator, 1A 4.9 5.1 V, 1%, 3-Pin SOT-223 Source: Datasheet <https://www.diodes.com//assets/Datasheets/products_inactive_data/AZ1117.pdf>; DESCRIPTION: 1A 5V LDO Linear Voltage Reg SOT-223 Diodes Inc AZ1117H-5.0TRE1, Single Linear Voltage Regulator, 1A 4.9 5.1 V, 1%, 3-Pin SOT-223; HEIGHT: 1.8mm; MANUFACTURER_NAME: Diodes Incorporated; MANUFACTURER_PART_NUMBER: AZ1117H-5.0TRE1; MOUSER_PART_NUMBER: 621-AZ1117H-5.0TRE1; MOUSER_PRICE-STOCK: https://www.mouser.co.uk/ProductDetail/Diodes-Incorporated/AZ1117H-5.0TRE1?qs=FKu9oBikfSlW5RUAHfdJtw%3D%3D
U$1 = Dual Mono Amp Library:TEENSY40: Teensy 4.0 device including POGO pins for pins 24 - 33, but not yet pins for D+ and D-. Symbol layout is what works for me and may not suite everyone... that can be added or additional symbols can be created to be used in a modilied davie name.
X1 = Dual Mono Amp Library:JST-XH-07-PIN: JST XH Connector 2 Pin Wire to board connector. Pitch: 2,54 mm, (0.100") Number of pins: 7 Created by Rembrandt Electronics www.rembrandtelectronics.com
X4 = Dual Mono Amp Library:JST-XH-04-PIN: JST XH Connector 2 Pin Wire to board connector. Pitch: 2,54 mm, (0.100") Number of pins: 4 Created by Rembrandt Electronics www.rembrandtelectronics.com

## Net classes
3 Power: width 1.27 mm, drill 1.27 mm, clearance 0.254 mm